# EAGLE schematic design (EAGLE 7.3.0)

## Sheet 1 of 7: MCU
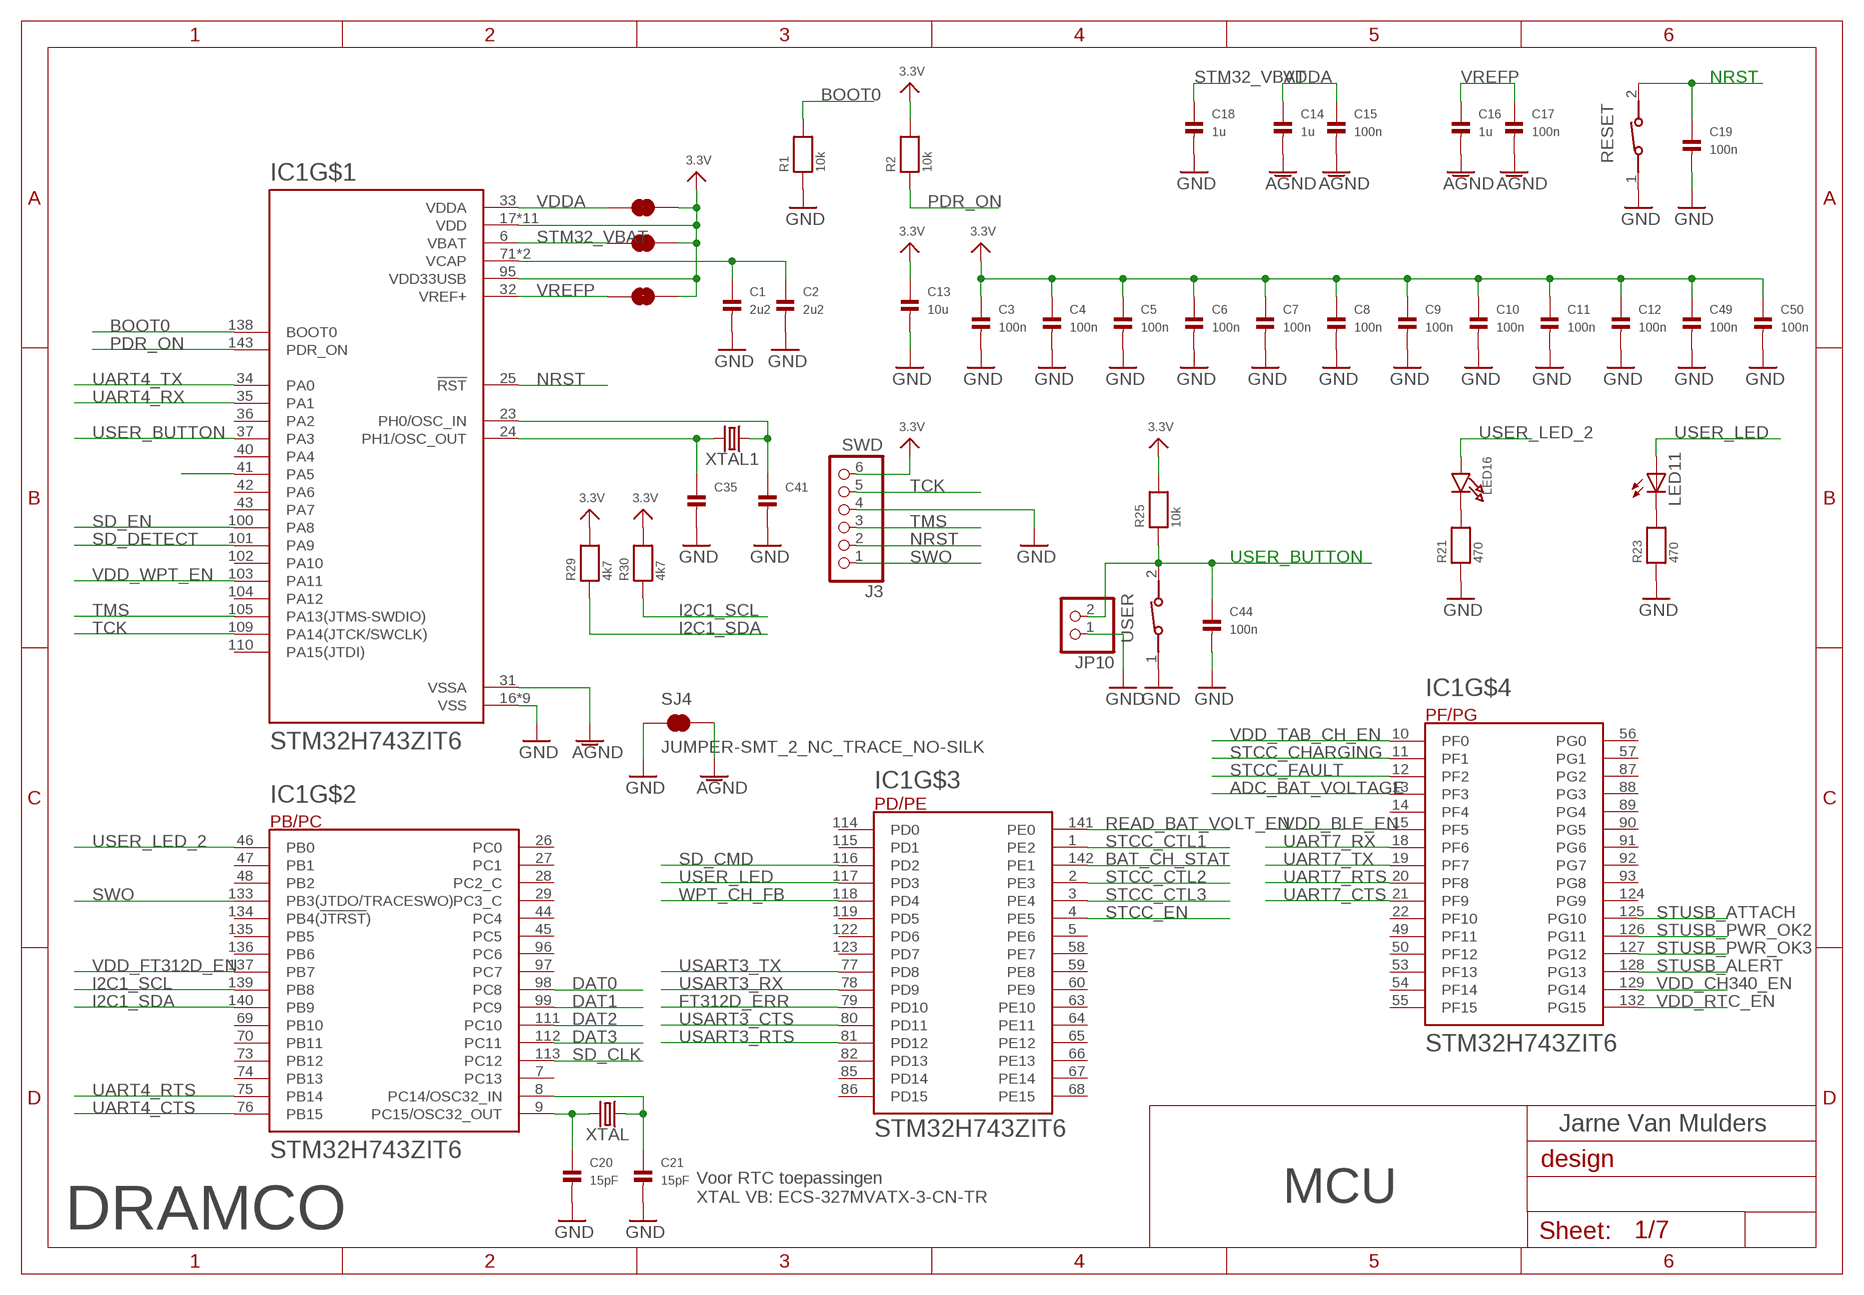
[diagram p0: schematic, sheet 1]

### Parts
C1  2u2  CAP_CERAMIC0805  [0805]
C2  2u2  CAP_CERAMIC0805  [0805]
C3  100n  CAP_CERAMIC0603  [0603]
C4  100n  CAP_CERAMIC0603  [0603]
C5  100n  CAP_CERAMIC0603  [0603]
C6  100n  CAP_CERAMIC0603  [0603]
C7  100n  CAP_CERAMIC0603  [0603]
C8  100n  CAP_CERAMIC0603  [0603]
C9  100n  CAP_CERAMIC0603  [0603]
C10  100n  CAP_CERAMIC0603  [0603]
C11  100n  CAP_CERAMIC0603  [0603]
C12  100n  CAP_CERAMIC0603  [0603]
C13  10u  CAP_CERAMIC0805  [0805]
C14  1u  CAP_CERAMIC0603  [0603]
C15  100n  CAP_CERAMIC0603  [0603]
C16  1u  CAP_CERAMIC0603  [0603]
C17  100n  CAP_CERAMIC0603  [0603]
C18  1u  CAP_CERAMIC0603  [0603]
C19  100n  CAP_CERAMIC0603  [0603]
C20  15pF  CAP_CERAMIC0603  [0603]
C21  15pF  CAP_CERAMIC0603  [0603]
C35  CAP_CERAMIC0603  [0603]
C41  CAP_CERAMIC0603  [0603]
C44  100n  CAP_CERAMIC0603  [0603]
C49  100n  CAP_CERAMIC0603  [0603]
C50  100n  CAP_CERAMIC0603  [0603]
IC1  STM32H743ZIT6  [QFP50P2200X2200X160-144N]
J3  SWD  HEADER-1X6ROUND  [1X06_ROUND]
JP10  HEADER-1X2ROUND  [1X02_ROUND]
LED11  LED3MM  [LED3MM]
LED16  LED0805  [CHIPLED_0805]
R1  10k  RESISTOR0603  [0603]
R2  10k  RESISTOR0603  [0603]
R21  470  RESISTOR0603  [0603]
R23  470  RESISTOR0603  [0603]
R25  10k  RESISTOR0603  [0603]
R29  4k7  RESISTOR0603  [0603]
R30  4k7  RESISTOR0603  [0603]
RESET  434111043826  [434111043826]
SJ1  JUMPER-SMT_2_NC_TRACE_NO-SILK  [SMT-JUMPER_2_NC_TRACE_NO-SILK]
SJ2  JUMPER-SMT_2_NC_TRACE_NO-SILK  [SMT-JUMPER_2_NC_TRACE_NO-SILK]
SJ3  JUMPER-SMT_2_NC_TRACE_NO-SILK  [SMT-JUMPER_2_NC_TRACE_NO-SILK]
SJ4  JUMPER-SMT_2_NC_TRACE_NO-SILK  [SMT-JUMPER_2_NC_TRACE_NO-SILK]
USER  434111043826  [434111043826]
XTAL  CRYSTALSMD-3.2X2.5  [CRYSTAL-SMD-3.2X2.5MM]
XTAL1  CRYSTALSMD-3.2X2.5  [CRYSTAL-SMD-3.2X2.5MM]

### Nets
3.3V: C3.1 C4.1 C5.1 C6.1 C7.1 C8.1 C9.1 C10.1 C11.1 C12.1 C13.1 C49.1 C50.1 IC1.17(VDD) IC1.30(VDD) IC1.39(VDD) IC1.52(VDD) IC1.62(VDD) IC1.72(VDD) IC1.84(VDD) IC1.95(VDD33USB) IC1.108(VDD) IC1.121(VDD) IC1.131(VDD) IC1.144(VDD) J3.6 R2.2 R25.2 R29.2 R30.2 SJ1.2 SJ2.2 SJ3.2 ; also sheet 2,3,4,5,6
ADC_BAT_VOLTAGE: IC1.13(PF3) ; also sheet 4
AGND: C14.2 C15.2 C16.2 C17.2 IC1.31(VSSA) SJ4.2
BAT_CH_STAT: IC1.142(PE1) ; also sheet 6
BOOT0: IC1.138(BOOT0) R1.2
DAT0: IC1.98(PC8) ; also sheet 5
DAT1: IC1.99(PC9) ; also sheet 5
DAT2: IC1.111(PC10) ; also sheet 5
DAT3: IC1.112(PC11) ; also sheet 5
FT312D_ERR: IC1.79(PD10) ; also sheet 3
GND: C1.2 C2.2 C3.2 C4.2 C5.2 C6.2 C7.2 C8.2 C9.2 C10.2 C11.2 C12.2 C13.2 C18.2 C19.2 C20.2 C21.2 C35.2 C41.2 C44.2 C49.2 C50.2 IC1.16(VSS) IC1.38(VSS) IC1.51(VSS) IC1.61(VSS) IC1.83(VSS) IC1.94(VSS) IC1.107(VSS) IC1.120(VSS) IC1.130(VSS) J3.4 JP10.1 R1.1 R21.1 R23.1 RESET.1 SJ4.1 USER.1 ; also sheet 2,3,4,5,6
I2C1_SCL: IC1.139(PB8) R30.1 ; also sheet 5,6
I2C1_SDA: IC1.140(PB9) R29.1 ; also sheet 5,6
N$2: C1.1 C2.1 IC1.71(VCAP) IC1.106(VCAP)
N$3: C20.1 IC1.9(PC15/OSC32_OUT) XTAL.3
N$4: C21.1 IC1.8(PC14/OSC32_IN) XTAL.1
N$9: IC1.41(PA5)
N$18: LED16.C R21.2
N$22: C35.1 IC1.24(PH1/OSC_OUT) XTAL1.3
N$38: LED11.K(C) R23.2
N$47: C41.1 IC1.23(PH0/OSC_IN) XTAL1.1
NRST: C19.1 IC1.25(!RST) J3.2 RESET.2
PDR_ON: IC1.143(PDR_ON) R2.1
READ_BAT_VOLT_EN: IC1.141(PE0) ; also sheet 4
SD_CLK: IC1.113(PC12) ; also sheet 5
SD_CMD: IC1.116(PD2) ; also sheet 5
SD_DETECT: IC1.101(PA9) ; also sheet 5
SD_EN: IC1.100(PA8) ; also sheet 5
STCC_CHARGING: IC1.11(PF1) ; also sheet 4
STCC_CTL1: IC1.1(PE2) ; also sheet 4
STCC_CTL2: IC1.2(PE3) ; also sheet 4
STCC_CTL3: IC1.3(PE4) ; also sheet 4
STCC_EN: IC1.4(PE5) ; also sheet 4
STCC_FAULT: IC1.12(PF2) ; also sheet 4
STM32_VBAT: C18.1 IC1.6(VBAT) SJ2.1
STUSB_ALERT: IC1.128(PG13) ; also sheet 6
STUSB_ATTACH: IC1.125(PG10) ; also sheet 6
STUSB_PWR_OK2: IC1.126(PG11) ; also sheet 6
STUSB_PWR_OK3: IC1.127(PG12) ; also sheet 6
SWO: IC1.133(PB3(JTDO/TRACESWO)) J3.1
TCK: IC1.109(PA14(JTCK/SWCLK)) J3.5
TMS: IC1.105(PA13(JTMS-SWDIO)) J3.3
UART4_CTS: IC1.76(PB15) ; also sheet 2
UART4_RTS: IC1.75(PB14) ; also sheet 2
UART4_RX: IC1.35(PA1) ; also sheet 2
UART4_TX: IC1.34(PA0) ; also sheet 2
UART7_CTS: IC1.21(PF9) ; also sheet 3
UART7_RTS: IC1.20(PF8) ; also sheet 3
UART7_RX: IC1.18(PF6) ; also sheet 3
UART7_TX: IC1.19(PF7) ; also sheet 3
USART3_CTS: IC1.80(PD11) ; also sheet 3
USART3_RTS: IC1.81(PD12) ; also sheet 3
USART3_RX: IC1.78(PD9) ; also sheet 3
USART3_TX: IC1.77(PD8) ; also sheet 3
USER_BUTTON: C44.1 IC1.37(PA3) JP10.2 R25.1 USER.2
USER_LED: IC1.117(PD3) LED11.A
USER_LED_2: IC1.46(PB0) LED16.A
VDD_BLE_EN: IC1.15(PF5) ; also sheet 2
VDD_CH340_EN: IC1.129(PG14) ; also sheet 3
VDD_FT312D_EN: IC1.137(PB7) ; also sheet 3
VDD_RTC_EN: IC1.132(PG15) ; also sheet 5
VDD_TAB_CH_EN: IC1.10(PF0) ; also sheet 4
VDD_WPT_EN: IC1.103(PA11) ; also sheet 4
VDDA: C14.1 C15.1 IC1.33(VDDA) SJ3.1
VREFP: C16.1 C17.1 IC1.32(VREF+) SJ1.1
WPT_CH_FB: IC1.118(PD4) ; also sheet 4
Unconnected: IC1.5(PE6) IC1.7(PC13) IC1.14(PF4) IC1.22(PF10) IC1.26(PC0) IC1.27(PC1) IC1.28(PC2_C) IC1.29(PC3_C) IC1.36(PA2) IC1.40(PA4) IC1.42(PA6) IC1.43(PA7) IC1.44(PC4) IC1.45(PC5) IC1.47(PB1) IC1.48(PB2) IC1.49(PF11) IC1.50(PF12) IC1.53(PF13) IC1.54(PF14) IC1.55(PF15) IC1.56(PG0) IC1.57(PG1) IC1.58(PE7) IC1.59(PE8) IC1.60(PE9) IC1.63(PE10) IC1.64(PE11) IC1.65(PE12) IC1.66(PE13) IC1.67(PE14) IC1.68(PE15) IC1.69(PB10) IC1.70(PB11) IC1.73(PB12) IC1.74(PB13) IC1.82(PD13) IC1.85(PD14) IC1.86(PD15) IC1.87(PG2) IC1.88(PG3) IC1.89(PG4) IC1.90(PG5) IC1.91(PG6) IC1.92(PG7) IC1.93(PG8) IC1.96(PC6) IC1.97(PC7) IC1.102(PA10) IC1.104(PA12) IC1.110(PA15(JTDI)) IC1.114(PD0) IC1.115(PD1) IC1.119(PD5) IC1.122(PD6) IC1.123(PD7) IC1.124(PG9) IC1.134(PB4(!JTRST!)) IC1.135(PB5) IC1.136(PB6)

### Notes on the sheet
- Jarne Van Mulders
- Voor RTC toepassingen
  XTAL VB: ECS-327MVATX-3-CN-TR
- MCU
- DRAMCO

## Sheet 2 of 7: Bluetooth
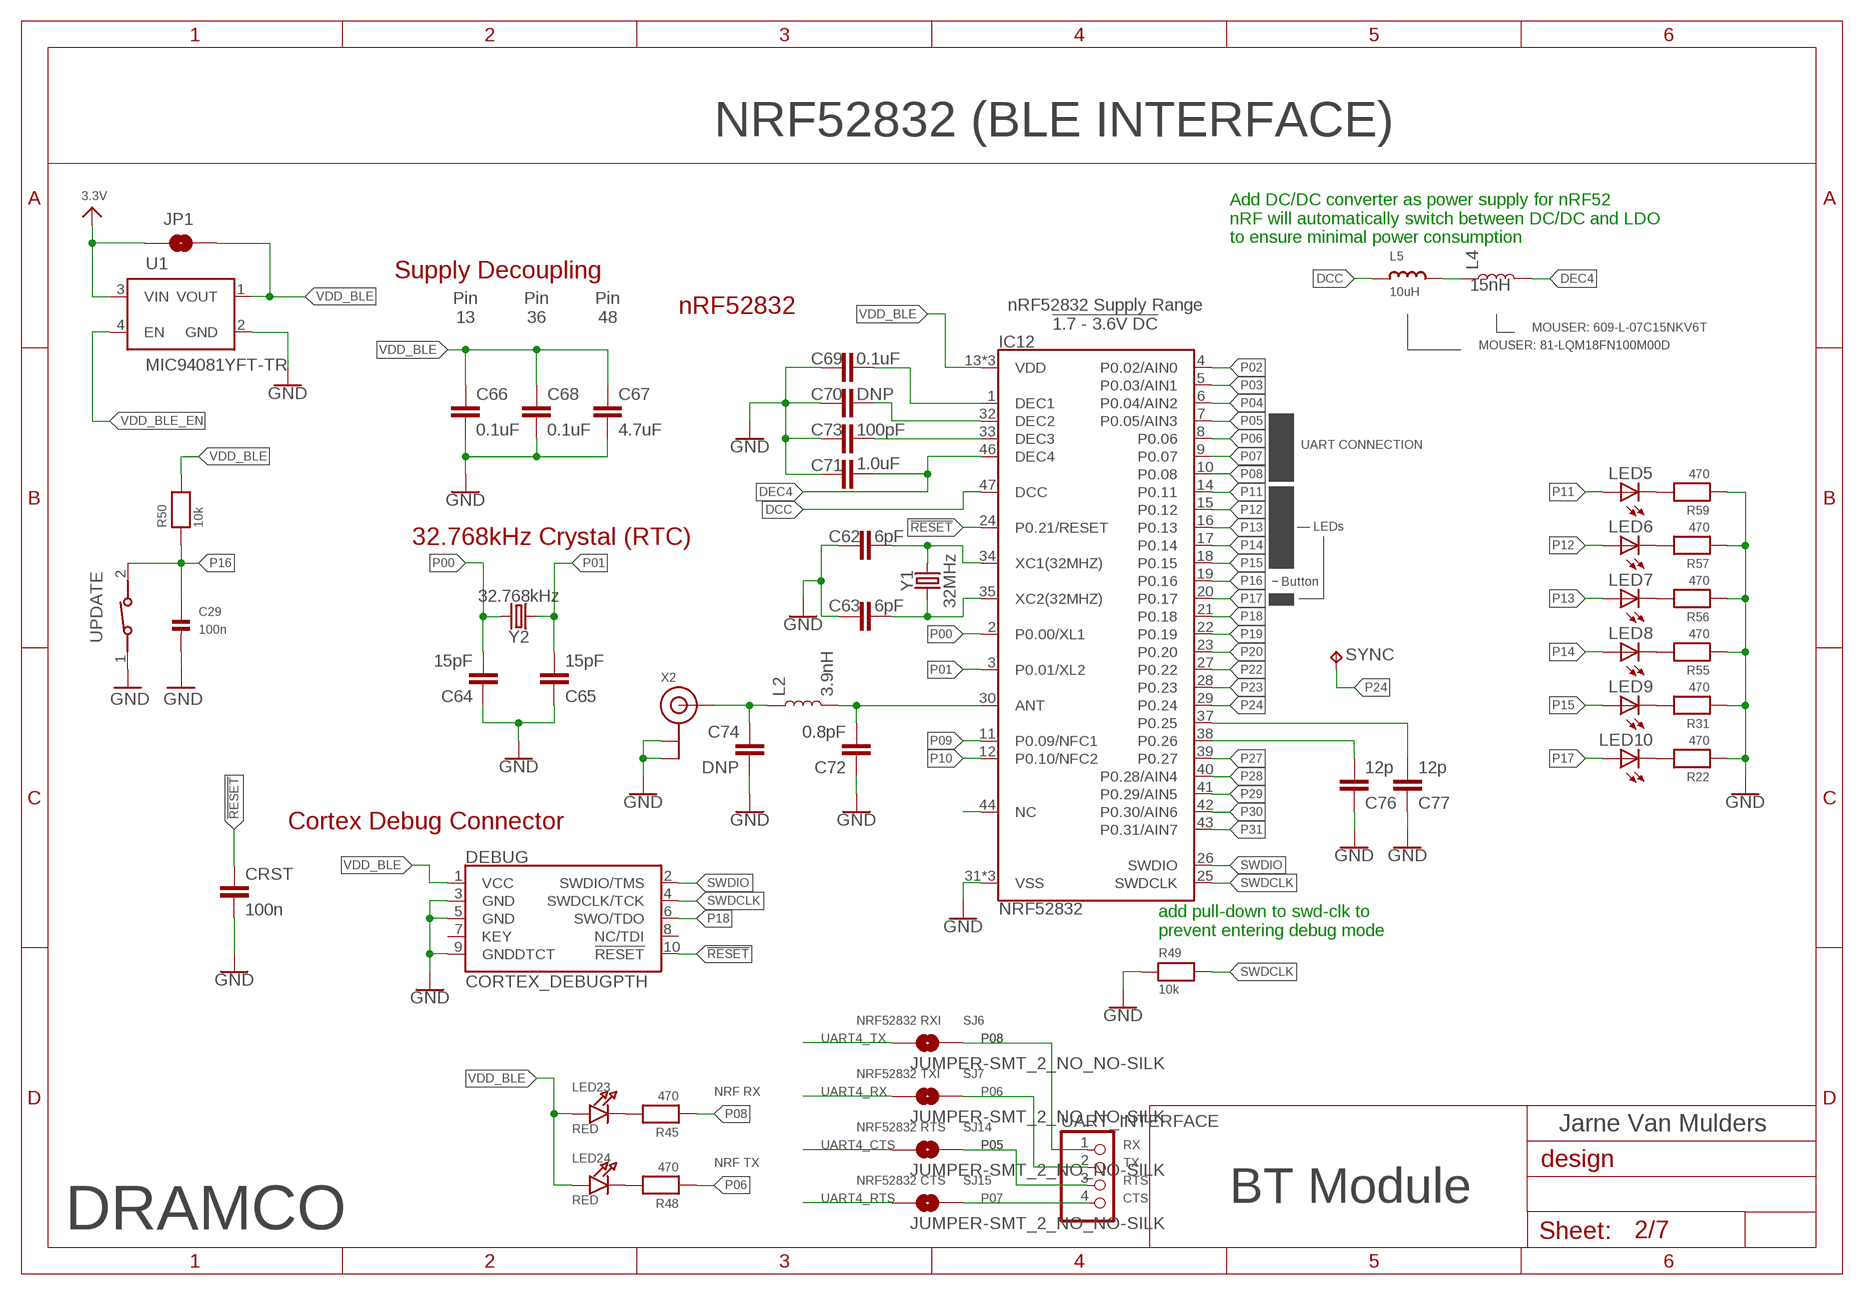
[diagram p1: schematic, sheet 2]

### Parts
C29  100n  CAP_CERAMIC0603  [0603]
C62  6pF  6PF-0402-50V-0.5%  [0402]
C63  6pF  6PF-0402-50V-0.5%  [0402]
C64  15pF  15PF-0402-50V-5%  [0402]
C65  15pF  15PF-0402-50V-5%  [0402]
C66  0.1uF  0.1UF-0402-16V-10%  [0402]
C67  4.7uF  4.7UF0603  [0603]
C68  0.1uF  0.1UF-0402-16V-10%  [0402]
C69  0.1uF  0.1UF-0402-16V-10%  [0402]
C70  DNP  CAP0402  [0402]
C71  1.0uF  1.0UF-0402-16V-10%  [0402]
C72  0.8pF  0.8PF-0402-50V-0.1PF  [0402]
C73  100pF  100PF-0402-50V-5%  [0402]
C74  DNP  CAP0402  [0402]
C76  12p  15PF-0402-50V-5%  [0402]
C77  12p  15PF-0402-50V-5%  [0402]
CRST  100n  C-EUC0603  [C0603]
DEBUG  CORTEX_DEBUGPTH  [2X5-PTH-1.27MM]
IC12  NRF52832  [QFN48-6X6MM]
JP1  JUMPER-SMT_2_NO_NO-SILK  [SMT-JUMPER_2_NO_NO-SILK]
L2  3.9nH  INDUCTOR-0402-3.9NH  [0402]
L4  15nH  INDUCTOR-0402-3.9NH  [0402]
L5  10uH  INDUCTOR_0603MP  [_0603MP]
LED5  LED3MM  [LED3MM]
LED6  LED3MM  [LED3MM]
LED7  LED3MM  [LED3MM]
LED8  LED3MM  [LED3MM]
LED9  LED3MM  [LED3MM]
LED10  LED3MM  [LED3MM]
LED23  RED  LED0805  [CHIPLED_0805]
LED24  RED  LED0805  [CHIPLED_0805]
R22  470  RESISTOR0603  [0603]
R31  470  RESISTOR0603  [0603]
R45  470  RESISTOR0603  [0603]
R48  470  RESISTOR0603  [0603]
R49  10k  RESISTOR0603  [0603]
R50  10k  RESISTOR0603  [0603]
R55  470  RESISTOR0603  [0603]
R56  470  RESISTOR0603  [0603]
R57  470  RESISTOR0603  [0603]
R59  470  RESISTOR0603  [0603]
SJ6  JUMPER-SMT_2_NO_NO-SILK  [SMT-JUMPER_2_NO_NO-SILK]
SJ7  JUMPER-SMT_2_NO_NO-SILK  [SMT-JUMPER_2_NO_NO-SILK]
SJ14  JUMPER-SMT_2_NO_NO-SILK  [SMT-JUMPER_2_NO_NO-SILK]
SJ15  JUMPER-SMT_2_NO_NO-SILK  [SMT-JUMPER_2_NO_NO-SILK]
SYNC  TPTP09R  [TP09R]
U1  MIC94081YFT-TR  [IC_MIC94081YFT-TR]
UART_INTERFACE  HEADER-1X4ROUND  [1X04_ROUND]
UPDATE  434111043826  [434111043826]
X2  ANTENNA_U.FL  [U.FL]
Y1  32MHz  CRYSTAL-32MHZ-SMD-2.0X1.6MM  [CRYSTAL-SMD-2.0X1.6MM]
Y2  32.768kHz  CRYSTAL-32.768KHZSMD-3.2X1.5  [CRYSTAL-SMD-3.2X1.5MM]

### Nets
3.3V: JP1.1 U1.3(VIN) ; also sheet 1,3,4,5,6
!RESET!: CRST.1 DEBUG.10(!RESET) IC12.24(P0.21/RESET)
ANT: C72.2 IC12.30(ANT) L2.2
DCC: IC12.47(DCC) L5.1
DEC4: C71.2 IC12.46(DEC4) L4.2
DEC5: C69.2 IC12.1(DEC1)
DEC6: C70.2 IC12.32(DEC2)
DEC8: C73.2 IC12.33(DEC3)
GND: C29.2 C62.1 C63.2 C64.1 C65.1 C66.2 C67.2 C68.2 C69.1 C70.1 C71.1 C72.1 C73.1 C74.2 C76.1 C77.1 CRST.2 DEBUG.3(GND) DEBUG.5(GND) DEBUG.9(GNDDTCT) IC12.31(VSS) IC12.45(VSS) IC12.EP(VSS) R22.1 R31.1 R49.1 R55.1 R56.1 R57.1 R59.1 U1.2(GND) UPDATE.1 X2.1(GND) X2.2(GND) ; also sheet 1,3,4,5,6
N$10: LED10.K(C) R22.2
N$11: LED9.K(C) R31.2
N$19: LED8.K(C) R55.2
N$45: C74.1 L2.1 X2.3(SIGNAL)
N$46: LED7.K(C) R56.2
N$48: LED6.K(C) R57.2
N$49: LED23.C R45.2
N$50: C77.2 IC12.37(P0.25)
N$51: LED24.C R48.2
N$53: L4.1 L5.2
N$61: LED5.K(C) R59.2
NC: IC12.44(NC)
P00: C64.2 IC12.2(P0.00/XL1) Y2.P$2
P01: C65.2 IC12.3(P0.01/XL2) Y2.P$1
P02: IC12.4(P0.02/AIN0)
P03: IC12.5(P0.03/AIN1)
P04: IC12.6(P0.04/AIN2)
P05: IC12.7(P0.05/AIN3) SJ14.2 UART_INTERFACE.3
P06: IC12.8(P0.06) R48.1 SJ7.2 UART_INTERFACE.2
P07: IC12.9(P0.07) SJ15.2 UART_INTERFACE.4
P08: IC12.10(P0.08) R45.1 SJ6.2 UART_INTERFACE.1
P09: IC12.11(P0.09/NFC1)
P10: IC12.12(P0.10/NFC2)
P11: IC12.14(P0.11) LED5.A
P12: IC12.15(P0.12) LED6.A
P13: IC12.16(P0.13) LED7.A
P14: IC12.17(P0.14) LED8.A
P15: IC12.18(P0.15) LED9.A
P16: C29.1 IC12.19(P0.16) R50.1 UPDATE.2
P17: IC12.20(P0.17) LED10.A
P18: DEBUG.6(SWO/TDO) IC12.21(P0.18)
P19: IC12.22(P0.19)
P20: IC12.23(P0.20)
P22: IC12.27(P0.22)
P23: IC12.28(P0.23)
P24: IC12.29(P0.24) SYNC.TP
P26: C76.2 IC12.38(P0.26)
P27: IC12.39(P0.27)
P28: IC12.40(P0.28/AIN4)
P29: IC12.41(P0.29/AIN5)
P30: IC12.42(P0.30/AIN6)
P31: IC12.43(P0.31/AIN7)
SWDCLK: DEBUG.4(SWDCLK/TCK) IC12.25(SWDCLK) R49.2
SWDIO: DEBUG.2(SWDIO/TMS) IC12.26(SWDIO)
UART4_CTS: SJ14.1 ; also sheet 1
UART4_RTS: SJ15.1 ; also sheet 1
UART4_RX: SJ7.1 ; also sheet 1
UART4_TX: SJ6.1 ; also sheet 1
VDD_BLE: C66.1 C67.1 C68.1 DEBUG.1(VCC) IC12.13(VDD) IC12.36(VDD) IC12.48(VDD) JP1.2 LED23.A LED24.A R50.2 U1.1(VOUT)
VDD_BLE_EN: U1.4(EN) ; also sheet 1
XC1: C62.2 IC12.34(XC1(32MHZ)) Y1.3
XC2: C63.1 IC12.35(XC2(32MHZ)) Y1.1
Unconnected: DEBUG.7(KEY) DEBUG.8(NC/TDI)

### Notes on the sheet
- NRF52832 (BLE INTERFACE)
- Add DC/DC converter as power supply for nRF52
  nRF will automatically switch between DC/DC and LDO
  to ensure minimal power consumption
- Supply Decoupling
- nRF52832
- nRF52832 Supply Range
  !1.7 - 3.6V DC!
- Pin
  13
- Pin
  36
- Pin
  48
- MOUSER: 609-L-07C15NKV6T
- MOUSER: 81-LQM18FN100M00D
- UART CONNECTION
- LEDs
- 32.768kHz Crystal (RTC)
- Button
- Cortex Debug Connector
- add pull-down to swd-clk to 
  prevent entering debug mode
- NRF52832 RXI
- NRF52832 TXI
- NRF RX
- NRF52832 RTS | Jarne Van Mulders
- RX
- NRF TX | TX
- NRF52832 CTS | RTS
- CTS | BT Module
- DRAMCO

## Sheet 3 of 7: USB Controllers
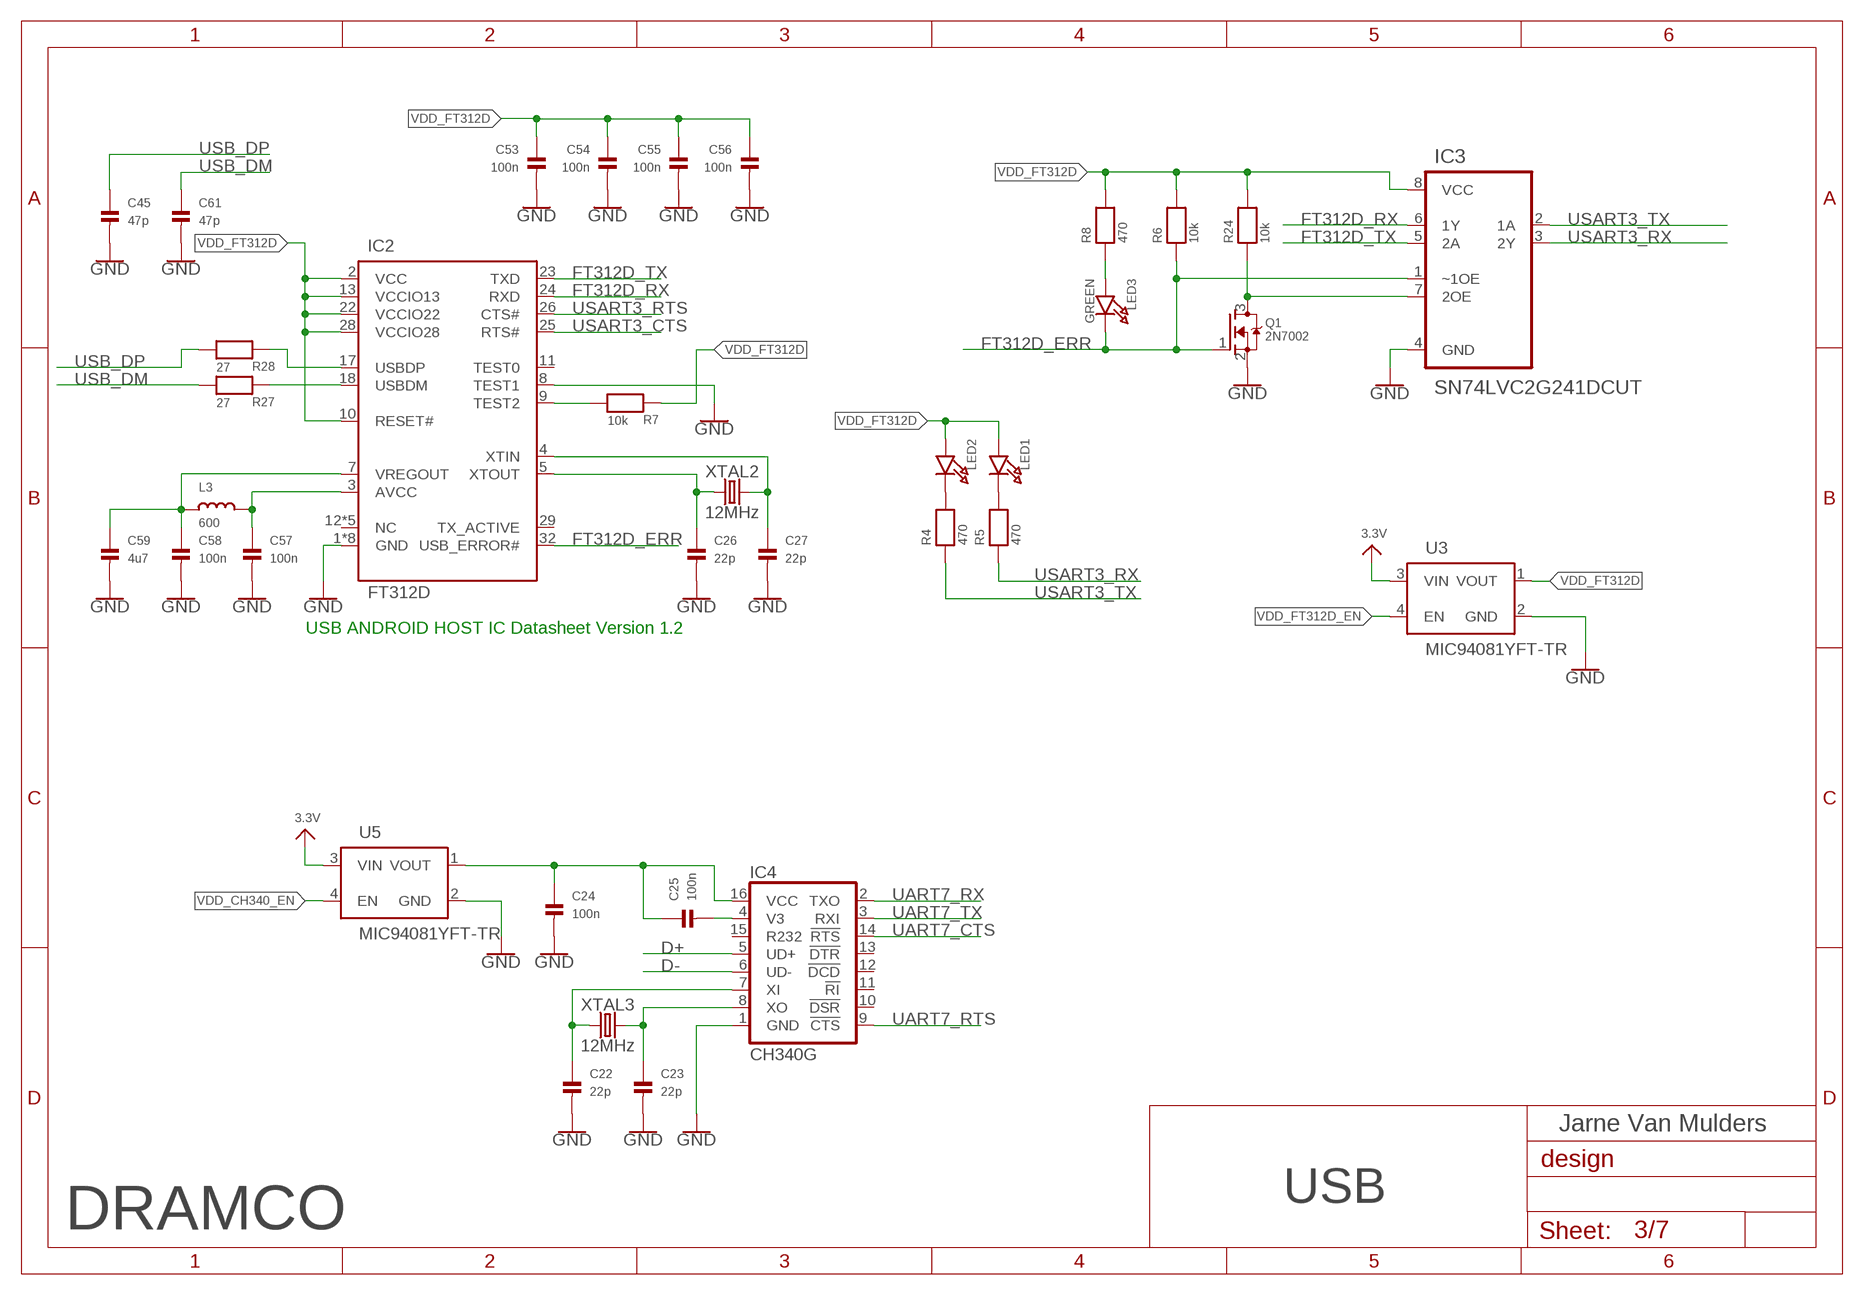
[diagram p2: schematic, sheet 3]

### Parts
C22  22p  CAP_CERAMIC0603  [0603]
C23  22p  CAP_CERAMIC0603  [0603]
C24  100n  CAP_CERAMIC0603  [0603]
C25  100n  CAP_CERAMIC0603  [0603]
C26  22p  CAP_CERAMIC0603  [0603]
C27  22p  CAP_CERAMIC0603  [0603]
C45  47p  CAP_CERAMIC0603  [0603]
C53  100n  CAP_CERAMIC0603  [0603]
C54  100n  CAP_CERAMIC0603  [0603]
C55  100n  CAP_CERAMIC0603  [0603]
C56  100n  CAP_CERAMIC0603  [0603]
C57  100n  CAP_CERAMIC0603  [0603]
C58  100n  CAP_CERAMIC0603  [0603]
C59  4u7  CAP_CERAMIC0603  [0603]
C61  47p  CAP_CERAMIC0603  [0603]
IC2  FT312D  [QFP80P900X900X160-32N]
IC3  SN74LVC2G241DCUT  [SOP50P310X90-8N]
IC4  CH340G  CH340GSMD  [SO016]
L3  600  INDUCTOR0603  [0603]
LED1  LED0805  [CHIPLED_0805]
LED2  LED0805  [CHIPLED_0805]
LED3  GREEN  LED0805  [CHIPLED_0805]
Q1  2N7002  MOSFET-NWIDE  [SOT23-WIDE]
R4  470  RESISTOR0603  [0603]
R5  470  RESISTOR0603  [0603]
R6  10k  RESISTOR0603  [0603]
R7  10k  RESISTOR0603  [0603]
R8  470  RESISTOR0603  [0603]
R24  10k  RESISTOR0603  [0603]
R27  27  RESISTOR0603  [0603]
R28  27  RESISTOR0603  [0603]
U3  MIC94081YFT-TR  [IC_MIC94081YFT-TR]
U5  MIC94081YFT-TR  [IC_MIC94081YFT-TR]
XTAL2  12MHz  CRYSTALSMD-3.2X2.5  [CRYSTAL-SMD-3.2X2.5MM]
XTAL3  12MHz  CRYSTALSMD-3.2X2.5  [CRYSTAL-SMD-3.2X2.5MM]

### Nets
3.3V: U3.3(VIN) U5.3(VIN) ; also sheet 1,2,4,5,6
D+: IC4.5(UD+) ; also sheet 6
D-: IC4.6(UD-) ; also sheet 6
FT312D_ERR: IC2.32(USB_ERROR#) IC3.1(~1OE) LED3.C Q1.1(G) R6.1 ; also sheet 1
FT312D_RX: IC2.24(RXD) IC3.6(1Y)
FT312D_TX: IC2.23(TXD) IC3.5(2A)
GND: C22.2 C23.2 C24.2 C26.2 C27.2 C45.2 C53.2 C54.2 C55.2 C56.2 C57.2 C58.2 C59.2 C61.2 IC2.1(GND) IC2.6(GND) IC2.8(TEST1) IC2.14(GND) IC2.15(GND) IC2.16(GND) IC2.19(GND) IC2.27(GND) IC2.33(GND) IC3.4(GND) IC4.1(GND) Q1.2(S) U3.2(GND) U5.2(GND) ; also sheet 1,2,4,5,6
N$1: LED2.C R4.2
N$5: LED1.C R5.2
N$6: C27.1 IC2.4(XTIN) XTAL2.3
N$7: C26.1 IC2.5(XTOUT) XTAL2.1
N$12: C24.1 C25.1 IC4.16(VCC) U5.1(VOUT)
N$13: LED3.A R8.1
N$14: IC2.9(TEST2) R7.1
N$15: IC3.7(2OE) Q1.3(D) R24.1
N$29: C22.1 IC4.7(XI) XTAL3.1
N$32: C23.1 IC4.8(XO) XTAL3.3
N$34: C25.2 IC4.4(V3)
N$41: C58.1 C59.1 IC2.7(VREGOUT) L3.1
N$42: C57.1 IC2.3(AVCC) L3.2
N$43: IC2.18(USBDM) R27.2
N$44: IC2.17(USBDP) R28.2
UART7_CTS: IC4.14(!RTS) ; also sheet 1
UART7_RTS: IC4.9(!CTS) ; also sheet 1
UART7_RX: IC4.2(TXO) ; also sheet 1
UART7_TX: IC4.3(RXI) ; also sheet 1
USART3_CTS: IC2.25(RTS#) ; also sheet 1
USART3_RTS: IC2.26(CTS#) ; also sheet 1
USART3_RX: IC3.3(2Y) R5.1 ; also sheet 1
USART3_TX: IC3.2(1A) R4.1 ; also sheet 1
USB_DM: C61.1 R27.1 ; also sheet 4
USB_DP: C45.1 R28.1 ; also sheet 4
VDD_CH340_EN: U5.4(EN) ; also sheet 1
VDD_FT312D: C53.1 C54.1 C55.1 C56.1 IC2.2(VCC) IC2.10(RESET#) IC2.13(VCCIO13) IC2.22(VCCIO22) IC2.28(VCCIO28) IC3.8(VCC) LED1.A LED2.A R6.2 R7.2 R8.2 R24.2 U3.1(VOUT)
VDD_FT312D_EN: U3.4(EN) ; also sheet 1
Unconnected: IC2.11(TEST0) IC2.12(NC) IC2.20(NC) IC2.21(NC) IC2.29(TX_ACTIVE) IC2.30(NC) IC2.31(NC) IC4.10(!DSR) IC4.11(!RI) IC4.12(!DCD) IC4.13(!DTR) IC4.15(R232)

### Notes on the sheet
- USB ANDROID HOST IC Datasheet Version 1.2
- Jarne Van Mulders
- USB
- DRAMCO

## Sheet 4 of 7: Power
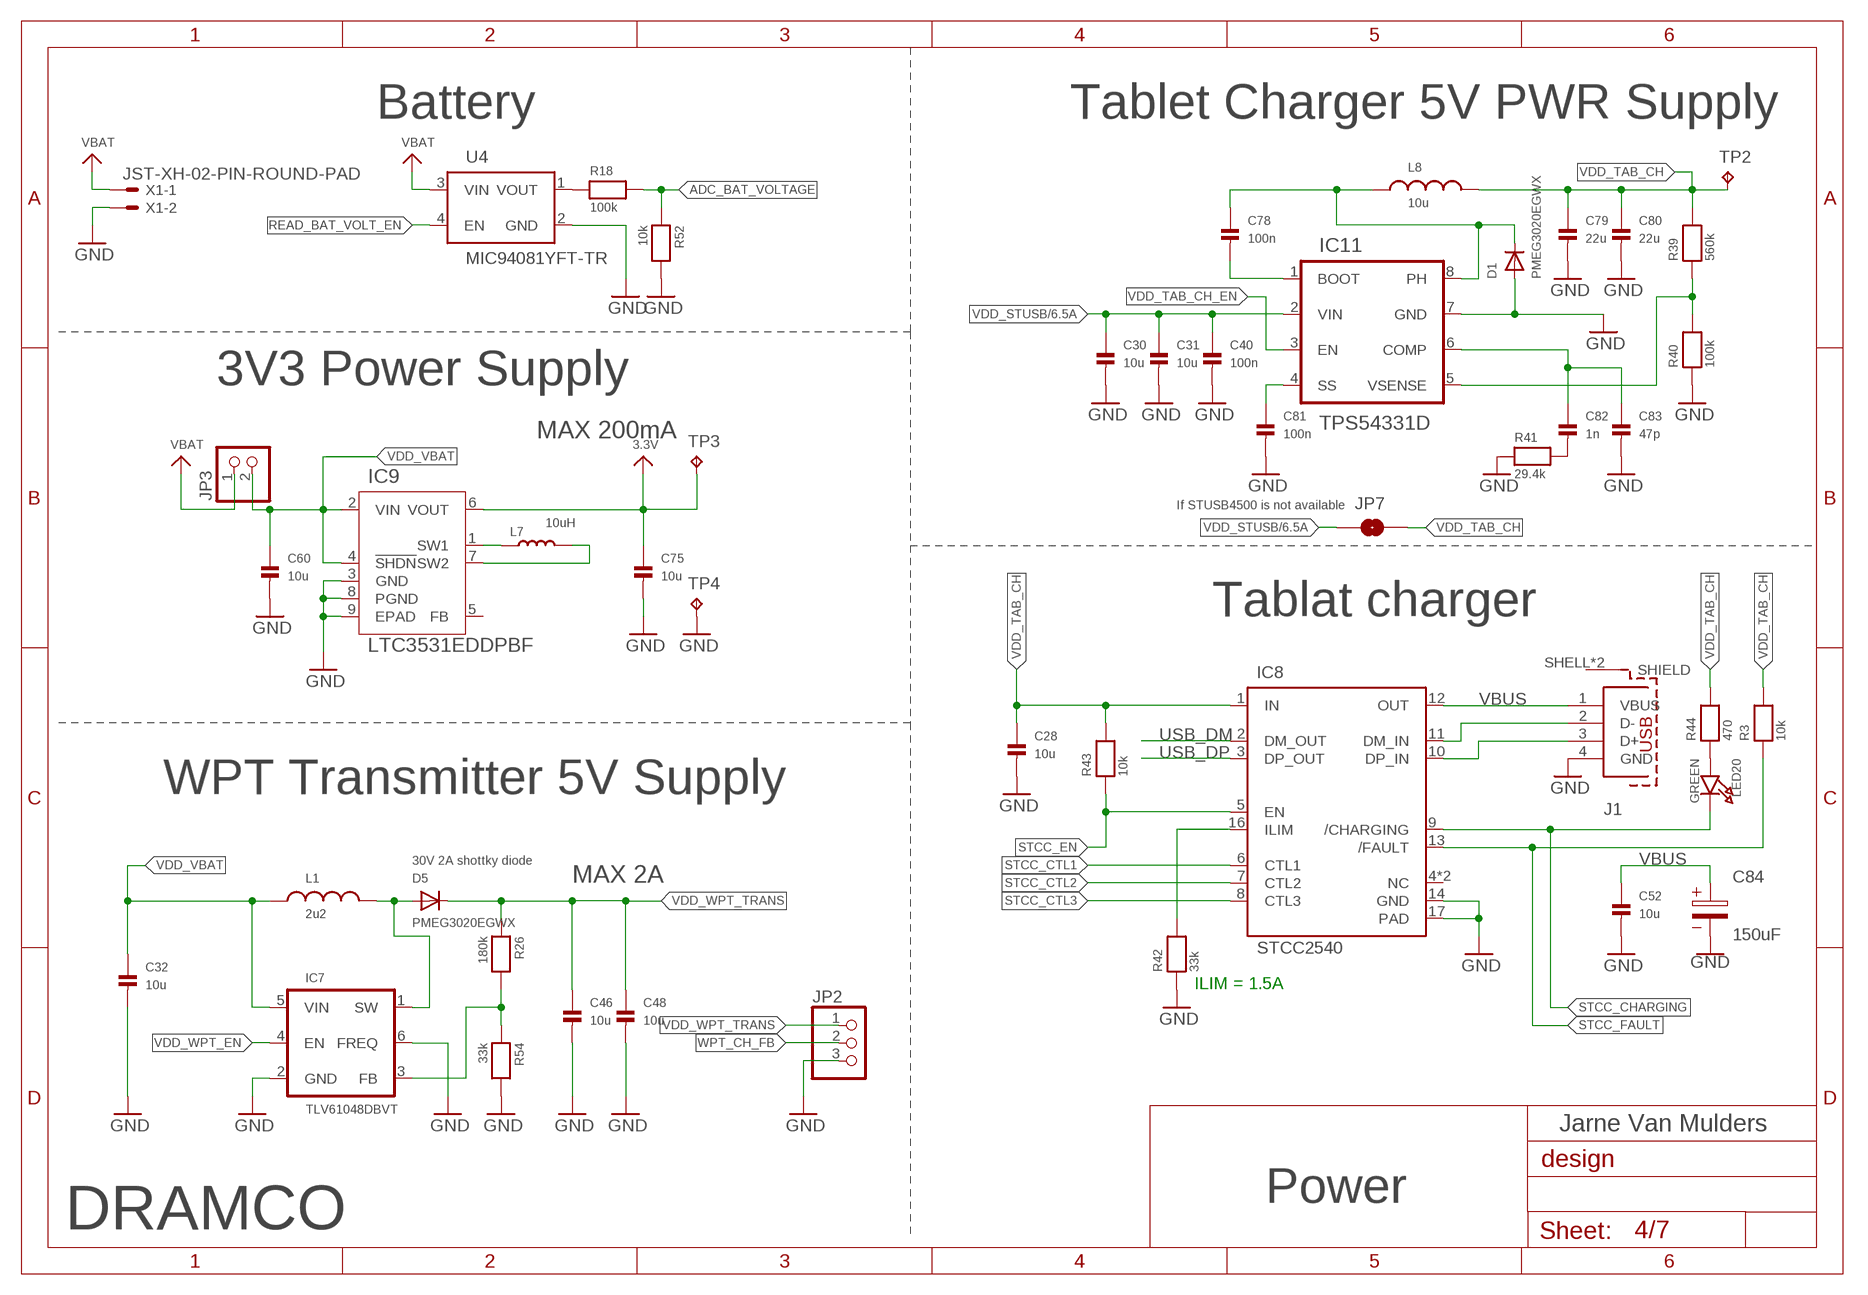
[diagram p3: schematic, sheet 4]

### Parts
C28  10u  CAP_CERAMIC0805  [0805]
C30  10u  CAP_CERAMIC0805  [0805]
C31  10u  CAP_CERAMIC0805  [0805]
C32  10u  CAP_CERAMIC0805  [0805]
C40  100n  CAP_CERAMIC0603  [0603]
C46  10u  CAP_CERAMIC0805  [0805]
C48  10u  CAP_CERAMIC0805  [0805]
C52  10u  CAP_CERAMIC0805  [0805]
C60  10u  CAP_CERAMIC0805  [0805]
C75  10u  CAP_CERAMIC0805  [0805]
C78  100n  CAP_CERAMIC0402  [0402]
C79  22u  CAP_CERAMIC0805  [0805]
C80  22u  CAP_CERAMIC0805  [0805]
C81  100n  CAP_CERAMIC0603  [0603]
C82  1n  CAP_CERAMIC0603  [0603]
C83  47p  CAP_CERAMIC0603  [0603]
C84  150uF  WCAP-ASLI_6,3X5,5_865080143008  [3.5X1.6X2.1(BXCXA)]
D1  PMEG3020EGWX  DIODESOD-123  [SOD-123]
D5  PMEG3020EGWX  DIODESOD-123  [SOD-123]
IC7  TLV61048DBVT  [SOT95P280X145-6N]
IC8  STCC2540  [QFN50P300X300X80-17N]
IC9  LTC3531EDDPBF  [DFN-8_DD]
IC11  TPS54331D  [SOIC127P599X175-8N]
J1  614004190021  [614004190021]
JP2  HEADER-1X3ROUND  [1X03_ROUND]
JP3  HEADER-1X2ROUND  [1X02_ROUND]
JP7  JUMPER-SMT_2_NO_NO-SILK  [SMT-JUMPER_2_NO_NO-SILK]
L1  2u2  WE-MAIA_3020_78438336022  [WE-MAIA_3020]
L7  10uH  SS4020-103MLB  [MSS4020]
L8  10u  WE-MAIA_4030_78438357100  [WE-MAIA_4030]
LED20  GREEN  LED0805  [CHIPLED_0805]
R3  10k  RESISTOR0603  [0603]
R18  100k  RESISTOR0603  [0603]
R26  180k  RESISTOR0603  [0603]
R39  560k  RESISTOR0603  [0603]
R40  100k  RESISTOR0603  [0603]
R41  29.4k  RESISTOR0603  [0603]
R42  33k  RESISTOR0603  [0603]
R43  10k  RESISTOR0603  [0603]
R44  470  RESISTOR0603  [0603]
R52  10k  RESISTOR0603  [0603]
R54  33k  RESISTOR0603  [0603]
TP2  TPTP10R  [TP10R]
TP3  TPTP10R  [TP10R]
TP4  TPTP10R  [TP10R]
U4  MIC94081YFT-TR  [IC_MIC94081YFT-TR]
X1  JST-XH-02-PIN-ROUND-PAD  [JST-XH-02-PACKAGE-ROUND-PAD]

### Nets
3.3V: C75.1 IC9.6(VOUT) TP3.TP ; also sheet 1,2,3,5,6
ADC_BAT_VOLTAGE: R18.2 R52.1 ; also sheet 1
GND: C28.2 C30.2 C31.2 C32.2 C40.2 C46.2 C48.2 C52.2 C60.2 C75.2 C79.2 C80.2 C81.2 C83.2 C84.2 D1.A IC7.2(GND) IC7.6(FREQ) IC8.14(GND) IC8.17(PAD) IC9.3(GND) IC9.8(PGND) IC9.9(EPAD) IC11.7(GND) J1.4(GND) JP2.3 R40.1 R41.1 R42.1 R52.2 R54.2 TP4.TP U4.2(GND) X1.2 ; also sheet 1,2,3,5,6
N$8: LED20.A R44.1
N$16: C78.1 D1.C IC11.8(PH) L8.1
N$17: D5.A IC7.1(SW) L1.2
N$24: IC8.16(ILIM) R42.2
N$28: R18.1 U4.1(VOUT)
N$33: C81.1 IC11.4(SS)
N$35: IC7.3(FB) R26.2 R54.1
N$36: C78.2 IC11.1(BOOT)
N$39: IC8.11(DM_IN) J1.2(D-)
N$40: IC8.10(DP_IN) J1.3(D+)
N$55: C82.1 C83.1 IC11.6(COMP)
N$57: IC11.5(VSENSE) R39.1 R40.2
N$60: C82.2 R41.2
READ_BAT_VOLT_EN: U4.4(EN) ; also sheet 1
STCC_CHARGING: IC8.9(/CHARGING) LED20.C ; also sheet 1
STCC_CTL1: IC8.6(CTL1) ; also sheet 1
STCC_CTL2: IC8.7(CTL2) ; also sheet 1
STCC_CTL3: IC8.8(CTL3) ; also sheet 1
STCC_EN: IC8.5(EN) R43.1 ; also sheet 1
STCC_FAULT: IC8.13(/FAULT) R3.1 ; also sheet 1
SW1: IC9.1(SW1) L7.1
SW2: IC9.7(SW2) L7.2
USB_DM: IC8.2(DM_OUT) ; also sheet 3
USB_DP: IC8.3(DP_OUT) ; also sheet 3
VBAT: JP3.1 U4.3(VIN) X1.1 ; also sheet 5,6
VBUS: C52.1 C84.1 IC8.12(OUT) J1.1(VBUS)
VDD_STUSB: C30.1 C31.1 C40.1 IC11.2(VIN) JP7.1 ; also sheet 6
VDD_TAB_CH: C28.1 C79.1 C80.1 IC8.1(IN) JP7.2 L8.2 R3.2 R39.2 R43.2 R44.2 TP2.TP
VDD_TAB_CH_EN: IC11.3(EN) ; also sheet 1
VDD_VBAT: C32.1 C60.1 IC7.5(VIN) IC9.2(VIN) IC9.4(!SHDN) JP3.2 L1.1
VDD_WPT_EN: IC7.4(EN) ; also sheet 1
VDD_WPT_TRANS: C46.1 C48.1 D5.C JP2.1 R26.1
WPT_CH_FB: JP2.2 ; also sheet 1
Unconnected: IC8.4(NC) IC8.15(NC) IC9.5(FB) J1.SHELL1(SHIELD) J1.SHELL(SHIELD)

### Notes on the sheet
- Battery | Tablet Charger 5V PWR Supply
- 3V3 Power Supply
- MAX 200mA
- If STUSB4500 is not available
- Tablat charger
- WPT Transmitter 5V Supply
- 30V 2A shottky diode
- MAX 2A
- ILIM = 1.5A
- Jarne Van Mulders
- Power
- DRAMCO

## Sheet 5 of 7: IO Exp
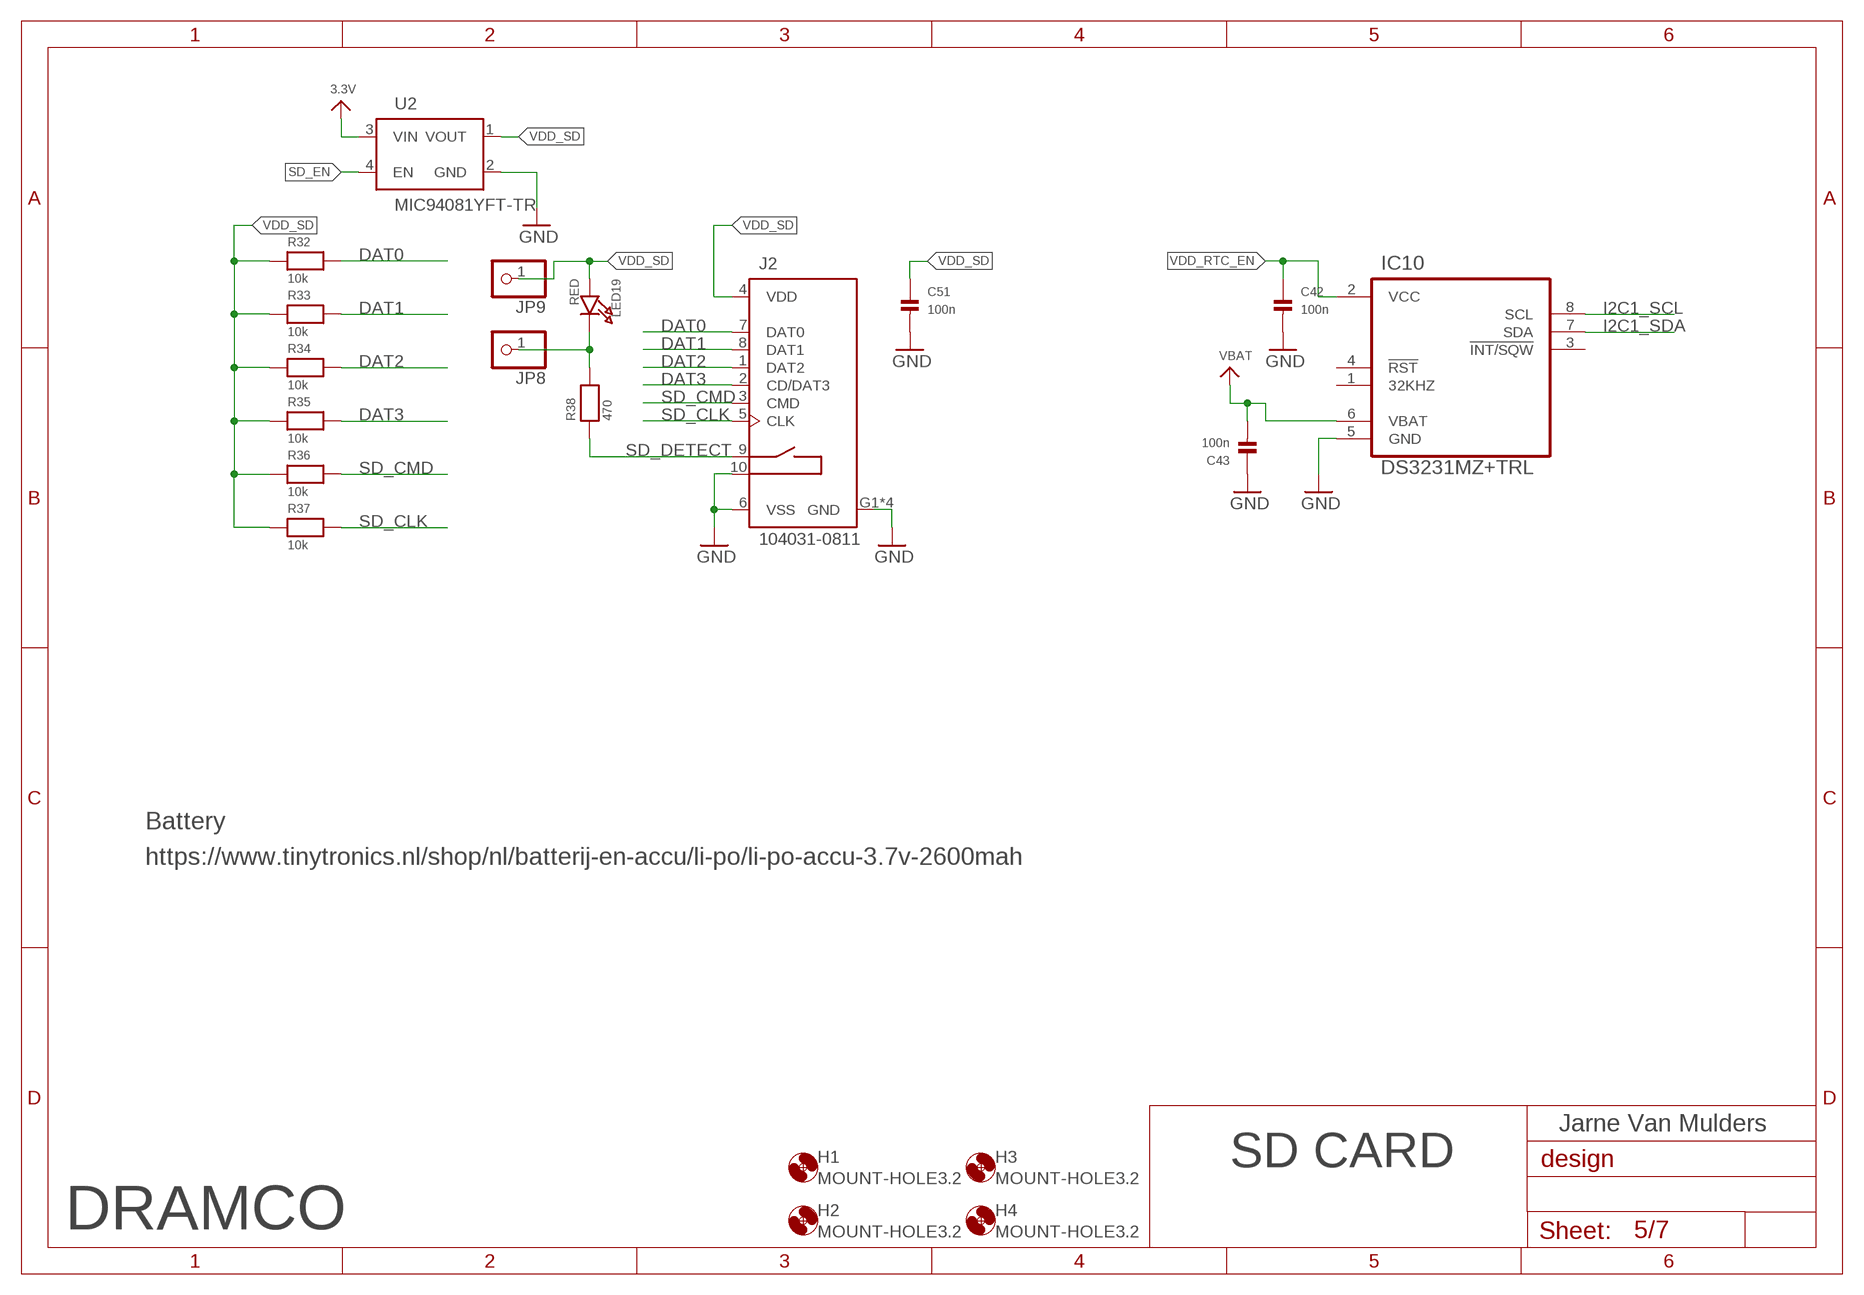
[diagram p4: schematic, sheet 5]

### Parts
C42  100n  CAP_CERAMIC0603  [0603]
C43  100n  CAP_CERAMIC0603  [0603]
C51  100n  CAP_CERAMIC0603  [0603]
H1  MOUNT-HOLE3.2  [3,2]
H2  MOUNT-HOLE3.2  [3,2]
H3  MOUNT-HOLE3.2  [3,2]
H4  MOUNT-HOLE3.2  [3,2]
IC10  DS3231MZ+TRL  [SOIC127P600X175-8N]
J2  104031-0811  [MOLEX_104031-0811]
JP8  HEADER-1X1ROUND  [1X01_ROUND]
JP9  HEADER-1X1ROUND  [1X01_ROUND]
LED19  RED  LED0805  [CHIPLED_0805]
R32  10k  RESISTOR0603  [0603]
R33  10k  RESISTOR0603  [0603]
R34  10k  RESISTOR0603  [0603]
R35  10k  RESISTOR0603  [0603]
R36  10k  RESISTOR0603  [0603]
R37  10k  RESISTOR0603  [0603]
R38  470  RESISTOR0603  [0603]
U2  MIC94081YFT-TR  [IC_MIC94081YFT-TR]

### Nets
3.3V: U2.3(VIN) ; also sheet 1,2,3,4,6
DAT0: J2.7(DAT0) R32.2 ; also sheet 1
DAT1: J2.8(DAT1) R33.2 ; also sheet 1
DAT2: J2.1(DAT2) R34.2 ; also sheet 1
DAT3: J2.2(CD/DAT3) R35.2 ; also sheet 1
GND: C42.2 C43.1 C51.2 IC10.5(GND) J2.6(VSS) J2.10(CARD_DET2) J2.G1(GND) J2.G2(GND) J2.G3(GND) J2.G4(GND) U2.2(GND) ; also sheet 1,2,3,4,6
I2C1_SCL: IC10.8(SCL) ; also sheet 1,6
I2C1_SDA: IC10.7(SDA) ; also sheet 1,6
N$20: JP8.1 LED19.C R38.2
SD_CLK: J2.5(CLK) R37.2 ; also sheet 1
SD_CMD: J2.3(CMD) R36.2 ; also sheet 1
SD_DETECT: J2.9(CARD_DET1) R38.1 ; also sheet 1
SD_EN: U2.4(EN) ; also sheet 1
VBAT: C43.2 IC10.6(VBAT) ; also sheet 4,6
VDD_RTC_EN: C42.1 IC10.2(VCC) ; also sheet 1
VDD_SD: C51.1 J2.4(VDD) JP9.1 LED19.A R32.1 R33.1 R34.1 R35.1 R36.1 R37.1 U2.1(VOUT)
Unconnected: IC10.1(32KHZ) IC10.3(!INT/SQW) IC10.4(!RST)

### Notes on the sheet
- Battery
- https://www.tinytronics.nl/shop/nl/batterij-en-accu/li-po/li-po-accu-3.7v-2600mah
- Jarne Van Mulders
- SD CARD
- DRAMCO

## Sheet 6 of 7
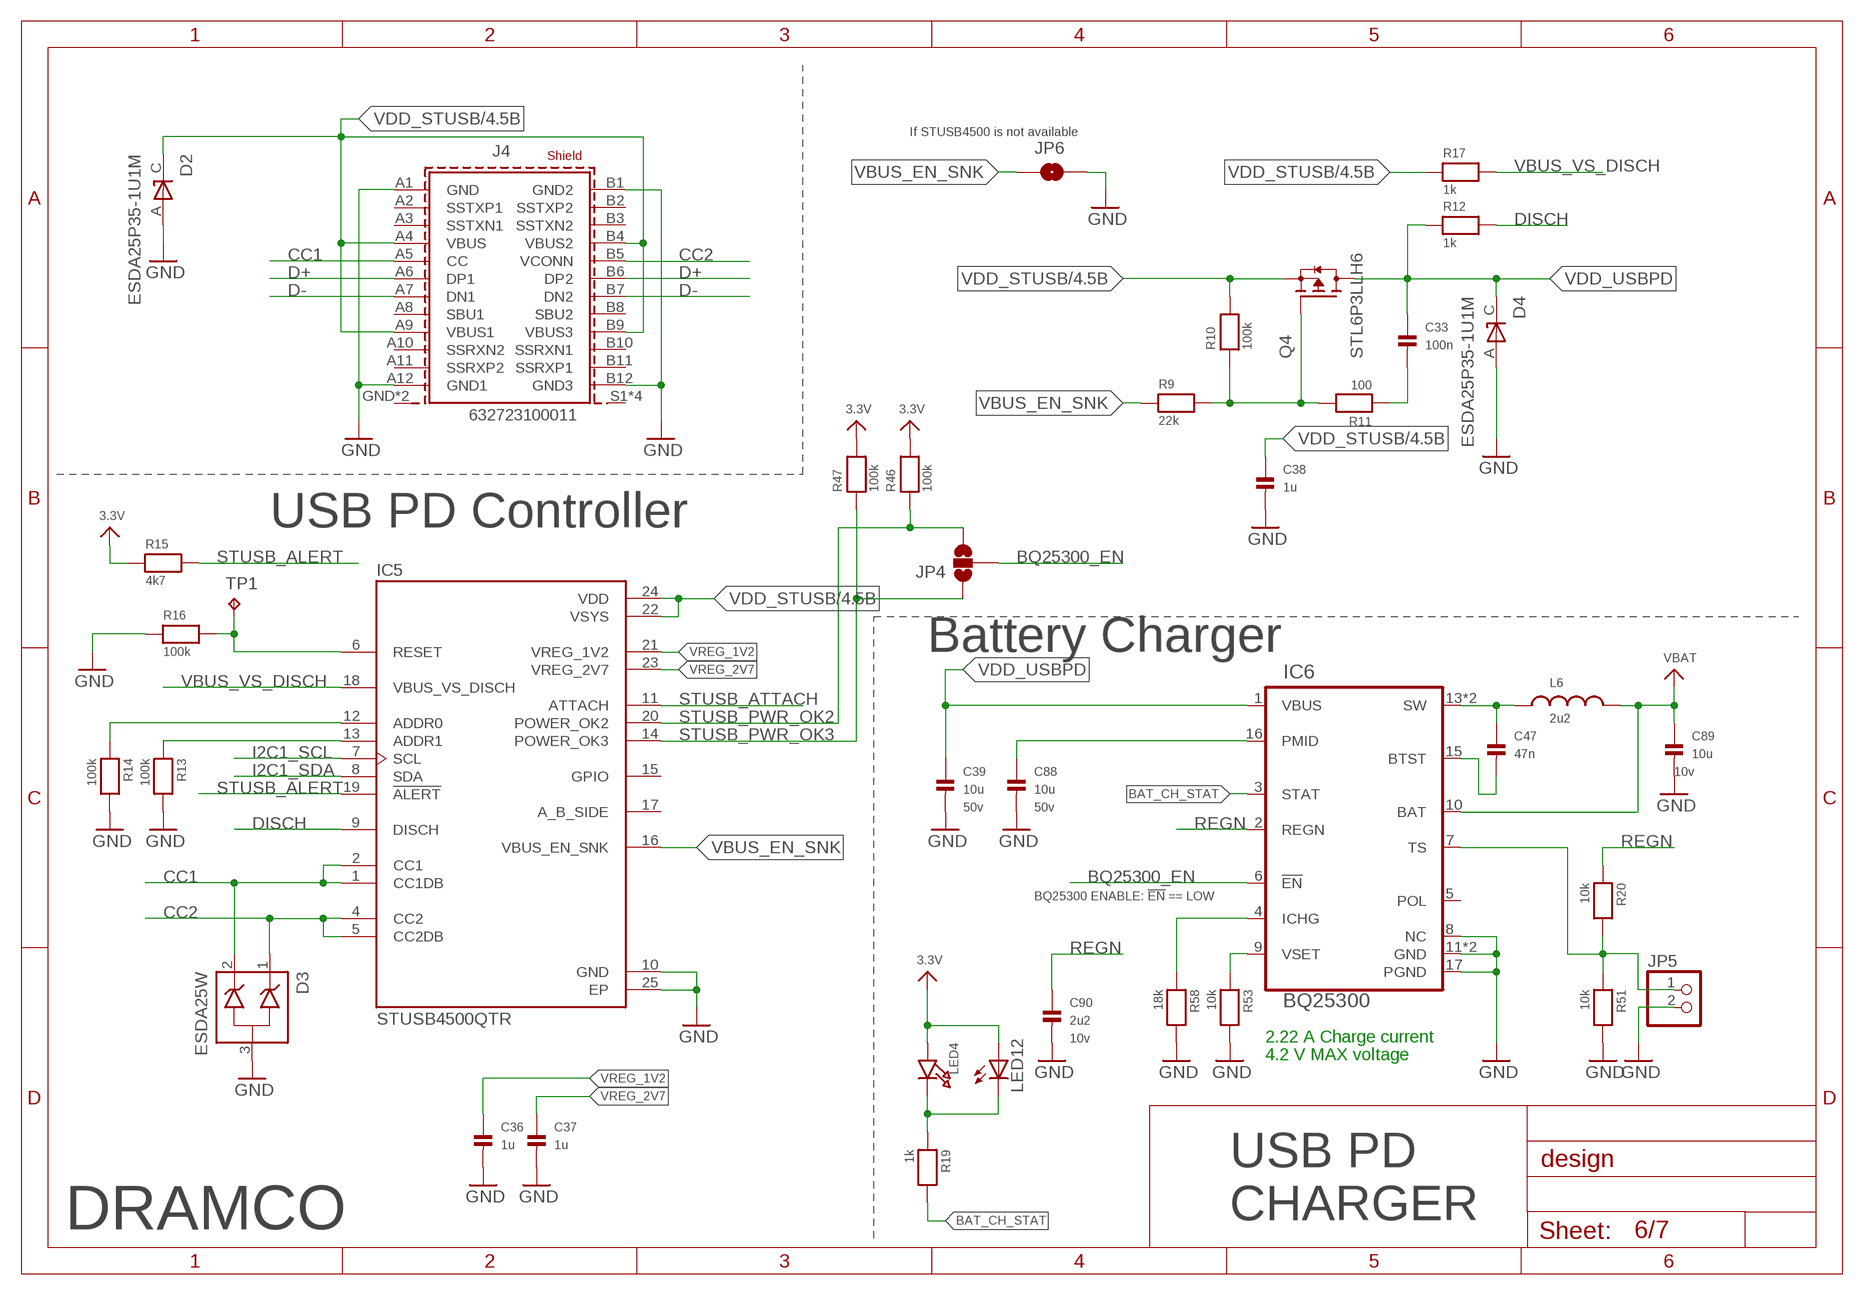
[diagram p5: schematic, sheet 6]

### Parts
C33  100n  CAP_CERAMIC0603  [0603]
C36  1u  CAP_CERAMIC0603  [0603]
C37  1u  CAP_CERAMIC0603  [0603]
C38  1u  CAP_CERAMIC0805  [0805]
C39  10u  CAP_CERAMIC1206  [1206]
C47  47n  CAP_CERAMIC0603  [0603]
C88  10u  CAP_CERAMIC1206  [1206]
C89  10u  CAP_CERAMIC0805  [0805]
C90  2u2  CAP_CERAMIC0603  [0603]
D2  ESDA25P35-1U1M  [TVS_ESDA25P35-1U1M]
D3  ESDA25W  [SOT65P210X110-3N]
D4  ESDA25P35-1U1M  [TVS_ESDA25P35-1U1M]
IC5  STUSB4500QTR  [QFN50P400X400X90-25N]
IC6  BQ25300  [QFN50P350X350X100-21N]
J4  632723100011  632723100011  [632723100011]
JP4  JUMPER-SMT_3_NO_NO-SILK  [SMT-JUMPER_3_NO_NO-SILK]
JP5  HEADER-1X2ROUND  [1X02_ROUND]
JP6  JUMPER-SMT_2_NO_NO-SILK  [SMT-JUMPER_2_NO_NO-SILK]
L6  2u2  WE-MAIA_3020_78438336022  [WE-MAIA_3020]
LED4  LED0805  [CHIPLED_0805]
LED12  LED3MM  [LED3MM]
Q4  STL6P3LLH6  [TRANS_STL6P3LLH6]
R9  22k  RESISTOR0603  [0603]
R10  100k  RESISTOR0603  [0603]
R11  100  RESISTOR0603  [0603]
R12  1k  RESISTOR0603  [0603]
R13  100k  RESISTOR0603  [0603]
R14  100k  RESISTOR0603  [0603]
R15  4k7  RESISTOR0603  [0603]
R16  100k  RESISTOR0603  [0603]
R17  1k  RESISTOR0603  [0603]
R19  1k  RESISTOR0603  [0603]
R20  10k  RESISTOR0603  [0603]
R46  100k  RESISTOR0603  [0603]
R47  100k  RESISTOR0603  [0603]
R51  10k  RESISTOR0603  [0603]
R53  10k  RESISTOR0603  [0603]
R58  18k  RESISTOR0603  [0603]
TP1  TPTP10R  [TP10R]

### Nets
3.3V: LED4.A LED12.A R15.1 R46.2 R47.2 ; also sheet 1,2,3,4,5
BAT_CH_STAT: IC6.3(STAT) R19.2 ; also sheet 1
BQ25300_EN: IC6.6(!EN) JP4.2
CC1: D3.2(C2) IC5.1(CC1DB) IC5.2(CC1) J4.A5(CC)
CC2: D3.1(C1) IC5.4(CC2) IC5.5(CC2DB) J4.B5(VCONN)
D+: J4.A6(DP1) J4.B6(DP2) ; also sheet 3
D-: J4.A7(DN1) J4.B7(DN2) ; also sheet 3
DISCH: IC5.9(DISCH) R12.2
GND: C36.2 C37.2 C38.2 C39.2 C88.2 C89.2 C90.2 D2.A D3.3(CA) D4.A IC5.10(GND) IC5.25(EP) IC6.8(NC) IC6.11(GND) IC6.12(GND) IC6.17(PGND) J4.A1(GND) J4.A12(GND1) J4.B1(GND2) J4.B12(GND3) JP5.2 JP6.2 R13.2 R14.2 R16.1 R51.2 R53.2 R58.2 ; also sheet 1,2,3,4,5
I2C1_SCL: IC5.7(SCL) ; also sheet 1,5
I2C1_SDA: IC5.8(SDA) ; also sheet 1,5
N$21: IC5.13(ADDR1) R13.1
N$23: C33.2 R11.1
N$25: Q4.4(G) R9.2 R10.1 R11.2
N$26: IC5.12(ADDR0) R14.1
N$27: IC5.6(RESET) R16.2 TP1.TP
N$30: IC6.9(VSET) R53.1
N$31: IC6.4(ICHG) R58.1
N$37: LED4.C LED12.K(C) R19.1
N$54: C47.2 IC6.15(BTST)
N$56: C88.1 IC6.16(PMID)
N$58: C47.1 IC6.13(SW) IC6.14(SW) L6.1
N$59: IC6.7(TS) JP5.1 R20.2 R51.1
REGN: C90.1 IC6.2(REGN) R20.1
STUSB_ALERT: IC5.19(!ALERT) R15.2 ; also sheet 1
STUSB_ATTACH: IC5.11(ATTACH) ; also sheet 1
STUSB_PWR_OK2: IC5.20(POWER_OK2) JP4.3 R46.1 ; also sheet 1
STUSB_PWR_OK3: IC5.14(POWER_OK3) JP4.1 R47.1 ; also sheet 1
VBAT: C89.1 IC6.10(BAT) L6.2 ; also sheet 4,5
VBUS_EN_SNK: IC5.16(VBUS_EN_SNK) JP6.1 R9.1
VBUS_VS_DISCH: IC5.18(VBUS_VS_DISCH) R17.2
VDD_STUSB: C38.1 D2.C IC5.22(VSYS) IC5.24(VDD) J4.A4(VBUS) J4.A9(VBUS1) J4.B4(VBUS2) J4.B9(VBUS3) Q4.1(S) Q4.2(S) Q4.3(S) R10.2 R17.1 ; also sheet 4
VDD_USBPD: C33.1 C39.1 D4.C IC6.1(VBUS) Q4.5_8(D) R12.1
VREG_1V2: C36.1 IC5.21(VREG_1V2)
VREG_2V7: C37.1 IC5.23(VREG_2V7)
Unconnected: IC5.15(GPIO) IC5.17(A_B_SIDE) IC6.5(POL) J4.A2(SSTXP1) J4.A3(SSTXN1) J4.A8(SBU1) J4.A10(SSRXN2) J4.A11(SSRXP2) J4.B2(SSTXP2) J4.B3(SSTXN2) J4.B8(SBU2) J4.B10(SSRXN1) J4.B11(SSRXP1) J4.GND1(SHIELD) J4.GND(SHIELD) J4.S1(SHIELD1) J4.S2(SHIELD1) J4.S3(SHIELD1) J4.S4(SHIELD1)

### Notes on the sheet
- If STUSB4500 is not available
- USB PD Controller
- Battery Charger
- 10v
- 50v | 50v
- BQ25300 ENABLE: !EN! == LOW
- 10v | 2.22 A Charge current
- 4.2 V MAX voltage
- USB PD
  CHARGER
- DRAMCO

## Sheet 7 of 7
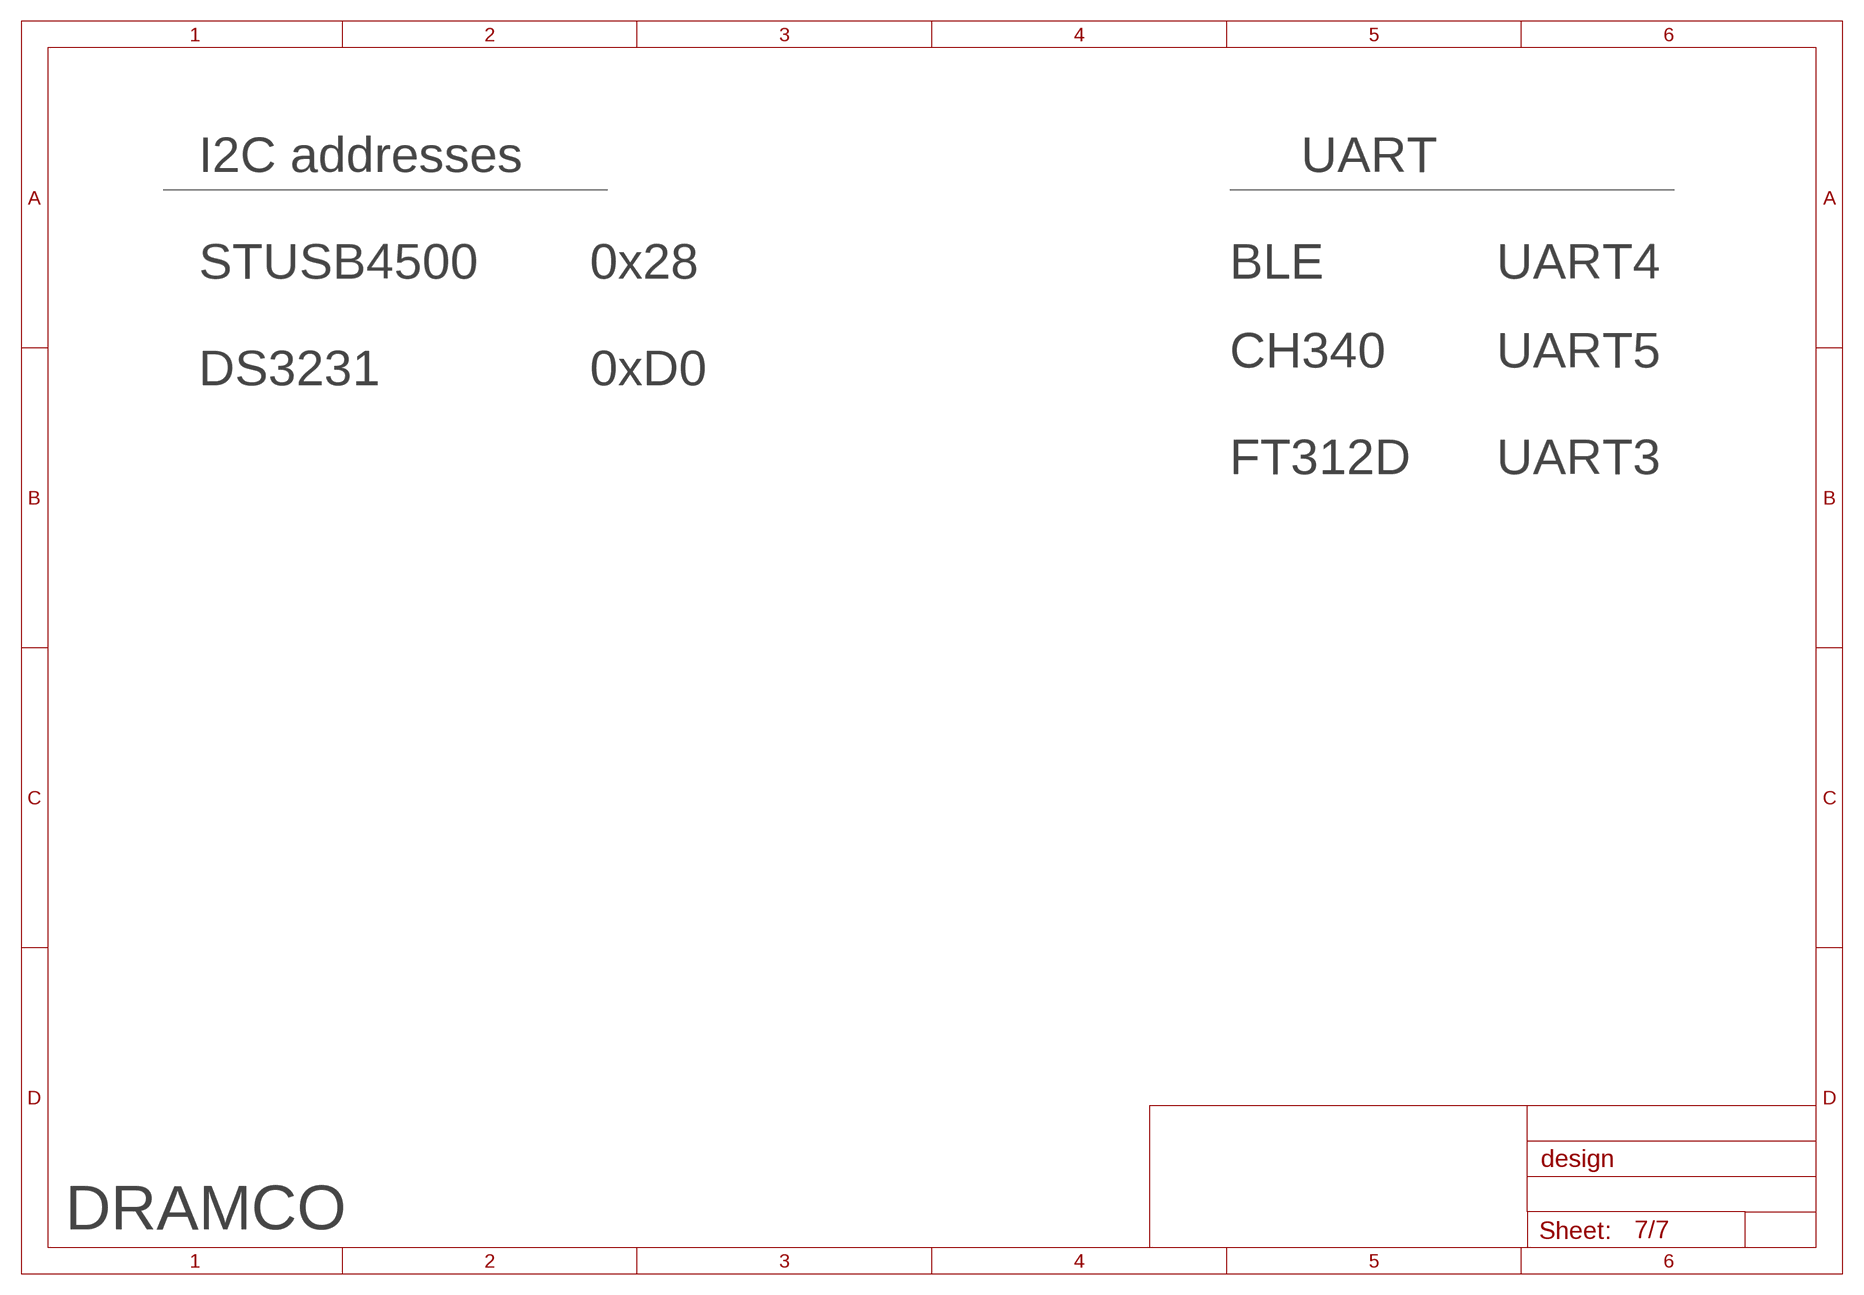
[diagram p6: schematic, sheet 7]

### Notes on the sheet
- I2C addresses | UART
- STUSB4500 | 0x28 | BLE | UART4
- CH340 | UART5
- DS3231 | 0xD0
- FT312D | UART3
- DRAMCO

## Library data of the parts
C1-C33 C35-C61 C75 C78-C83 C88-C90 = microbuilder:CAP_CERAMIC: Ceramic Capacitors 0402 - 0402 Surface Mount Capacitors 16pF 50V 5% [Digikey: 445-4899-2-ND] 18pF 50V 5% [Digikey: 490-1281-2-ND] 22pF 50V 5% [Digikey: 490-1283-2-ND] 68pF 50V 5% [Digikey: 490-1289-2-ND] 0.1uF 10V 10% [Digikey: 490-1318-2-ND] 1.0uF 6.3V 10% [Digikey: 490-1320-2-ND] 0603 - 0603 Surface Mount Capacitors 16 pF 50V 5% [Digikey: 445-5051-2-ND] 22 pF 50V [Digikey: PCC220ACVTR-ND] 33 pF 50V 5% [Digikey: 490-1415-1-ND] 56pF 50V 5% [Digikey: 490-1421-1-ND] 220pF 50V 5% [Digikey: 445-1285-1-ND] 680 pF 50V 2200 pF 50V 5% C0G [Digikey: 445-1297-1-ND] 5600 pF 100V 5% X7R [Digikey: 478-3711-1-ND] 0.1 µF 25V 10% [Digikey: PCC2277TR-ND] 0.22 µF 16V 10% X7R [Digikey: 445-1318-1-ND] 1.0 µF 25V 10% [Digikey: 445-5146-2-ND] 0603 - RF Specific 3pF 250V +/-0.1pF RF [Digikey: 712-1347-1-ND] 18 pF 250V 5% [Digikey: 478-3505-1-ND or 712-1322-1-ND] 56 pF 250V 5% C0G RF [Digikey: 490-4867-1-ND] 68 pF 250V RF [Digikey: 490-4868-1-ND] 0805 - 0805 Surface Mount Capacitors 220 pF 250V 2% RF Ceramic Capacitor [Digikey: 712-1398-1-ND] 1000 pF 50V 2% NP0 Ceramic Capacitor [Digikey: 478-3760-1-ND] 0.1 µF 25V 10% Ceramic Capacitor [Digikey: PCC1828TR-ND] 1.0 µF 16V 10% Ceramic Capacitor[Digikey: 490-1691-2-ND] 10.0 µF 10V 10% Ceramic Capacitor[Digikey: 709-1228-1-ND] 10.0 uF 16V 10% Ceramic Capacitor [Digikey: 478-5165-2-ND] 47 uF 6.3V 20% Ceramic Capacitor [Digikey: 587-1779-1-ND or 399-5506-1-ND] 1206 - 1206 Surface Mount Capacitors 47uF 10V 20% Ceramic Capacitor [Digikey: 490-5528-1-ND or 399-5508-1-ND or 445-6010-1-ND] 100uF 6.3V -20%, +80% Y5V Ceramic Capacitor (Digikey: 490-4512-1-ND, Mouser: 81-GRM31CF50J107ZE1L)
C62 C63 = nrf52832-breakout-temp:6PF: 15pF ceramic capacitors A capacitor is a passive two-terminal electrical component used to store electrical energy temporarily in an electric field.; PROD_ID: CAP-13455
C64 C65 = SparkFun-Capacitors:15PF: 15pF ceramic capacitors A capacitor is a passive two-terminal electrical component used to store electrical energy temporarily in an electric field.; PROD_ID: CAP-13063
C66 C68 C69 = SparkFun-Capacitors:0.1UF: 0.1µF ceramic capacitors A capacitor is a passive two-terminal electrical component used to store electrical energy temporarily in an electric field.; PROD_ID: CAP-12416
C67 = SparkFun-Capacitors:4.7UF: 4.7µF ceramic capacitors A capacitor is a passive two-terminal electrical component used to store electrical energy temporarily in an electric field.; PROD_ID: CAP-08280
C70 C74 = SparkFun-Passives:CAP: Capacitor Standard 0603 ceramic capacitor, and 0.1" leaded capacitor.
C71 = SparkFun-Capacitors:1.0UF: 1µF ceramic capacitors A capacitor is a passive two-terminal electrical component used to store electrical energy temporarily in an electric field.; PROD_ID: CAP-12417
C72 = nrf52832-breakout-temp:0.8PF: 0.8pF ceramic capacitors A capacitor is a passive two-terminal electrical component used to store electrical energy temporarily in an electric field.; PROD_ID: CAP-13456
C73 = nrf52832-breakout-temp:100PF: 100pF/0.1nF ceramic capacitors A capacitor is a passive two-terminal electrical component used to store electrical energy temporarily in an electric field.; PROD_ID: CAP-13458
C76 C77 = SparkFun-Capacitors:15PF: 15pF ceramic capacitors A capacitor is a passive two-terminal electrical component used to store electrical energy temporarily in an electric field.; PROD_ID: CAP-13063; VALUE: 15pF
C84 = Kondensatoren (rev17a):WCAP-ASLI: WCAP-ASLI Aluminum Electrolytic Capacitors Characteristics Aluminum Electrolytic Capacitor Recommended soldering: Reflow Operating temperature: -55 °C to +105 °C Low impedance product series Load life:2000 h @ +105 °C Package name and Variant abbreviation: Package: Package: B X C X A = length of the solder pad X width of the solder pad X pitch of the solder pad. <http://katalog.we-online.de/media/images/eisos/WCAP-ASLI_pf2.jpg> Details see: http://katalog.we-online.de/en/pbs/WCAP-ASLI Updated by: Yingchun,Shan Updated: 2017-03-16 2017 (C) Wurth Elektronik; WE-NUMBER: 865080143008/150uF
CRST = rcl:C-EU: CAPACITOR, European symbol; SPICEPREFIX: C
D1 D5 = microbuilder:DIODE: Diode SMA Model Volts Amps Type Vf Vr Digikey # Notes SSA34-E3 40V 3A Schottky 480mV @ 3A 200uA @ 40V SSA34-E3/61TGITR-ND CDBA120-G 20V 1A Schottky 500mV @ 1A 500uA @ 20V 641-1014-6-ND REEL MBRA210 10V 2A Schottky 350mV @ 2A 700uA @ 10V MBRA210LT3 SOD-123 Model Volts Amps Type Vf Vr Order # Notes BAT54T1G 30V 200mA Schottky 800mV @ 200mA 2uA @ 25V BAT54T1GOSTR-ND B0530W 30V 500mA Schottky 430mV @ 500mA 130uA @ 30V B0530W-FDICT-ND REEL MBR120 1A 20V Schottky 340mV @ 1A MBR120VLSFT1GOSCT-ND SOD-323 Model Volts Amps Type Vf Vr Order # Notes PMEG2005EJ 20V 500mA Schottky 355mV @ 500mA 568-4110-1-ND ZLLS410 10V 570mA Schottky 380mV @ 570mA ZLLS410CT-ND 1N4148WS 75V 150mA Silicon/Simple 1V 1N4148WSFSCT-ND REEL SOD-523 Model Volts Amps Type Vf Vr Order # Notes BAT54XV2 30V 200mA Schottky 0.8V @ 100mA BAT54XV2CT-ND TB751S 30V 30mA Schottky RB751S-40TE61CT-ND SOT23-R/W (R = Solder Paste/Reflow Ovens, W = Hand-Soldering) Model Volts Amps Type Vf Vr Order # Notes BAT54FILM 40V 300mA Schottky 497-7162-1-ND
D2 D4 = ESDA25P35-1U1M:ESDA25P35-1U1M: 41V Clamp 35A (8/20µs) Ipp Tvs Diode Surface Mount 1610 Check prices <https://pricing.snapeda.com/parts/ESDA25P35-1U1M/STMicroelectronics/view-part?ref=eda>; AVAILABILITY: In Stock; DESCRIPTION: 41V Clamp 35A (8/20µs) Ipp Tvs Diode Surface Mount 1610; MF: STMicroelectronics; MP: ESDA25P35-1U1M; PACKAGE: UDFN-2 STMicroelectronics; PRICE: None
D3 = ESDA25W:ESDA25W: Clamp Ipp Tvs Diode Surface Mount SOT-323 Check prices <https://pricing.snapeda.com/parts/ESDA25W/STMicroelectronics/view-part?ref=eda>; AVAILABILITY: In Stock; DESCRIPTION: Clamp Ipp Tvs Diode Surface Mount SOT-323; MF: STMicroelectronics; MP: ESDA25W; PACKAGE: SOT-323 STMicroelectronics; PRICE: None
DEBUG = SparkFun-Connectors:CORTEX_DEBUG: Cortex Debug Connector Datasheet <http://infocenter.arm.com/help/topic/com.arm.doc.faqs/attached/13634/cortex_debug_connectors.pdf>
H1-H4 = holes:MOUNT-HOLE: MOUNTING HOLE with drill center marker
IC1 = STM32H743ZIT6:STM32H743ZIT6: High-performance and DSP with DP-FPU, ARM Cortex-M7 MCU with 2MBytes Flash, 1MB RAM, 400 MHz CPU, Art Accelerator, L1...; AVAILABILITY: Unavailable; DESCRIPTION: ARM® Cortex®-M7 STM32H7 Microcontroller IC 32-Bit 480MHz 2MB _2M x 8_ FLASH 144-LQFP _20x20_; MF: STMicroelectronics; MP: STM32H743ZIT6; PACKAGE: LQFP-144 STMicroelectronics; PRICE: None
IC2 = FT312D:FT312D
IC3 = SN74LVC2G241DCUT:SN74LVC2G241DCUT: DUAL BUFFER/DRIVER WITH 3-STATE OUTPUTS; AVAILABILITY: Unavailable; DESCRIPTION: Buffer, Non-Inverting 2 Element 1 Bit per Element 3-State Output 8-VSSOP; MF: Texas Instruments; MP: SN74LVC2G241DCUT; PACKAGE: VFSOP-8 Texas Instruments; PRICE: None
IC4 = SparkFun-IC-Comms:CH340G: A simple USB 2.0 to Serial IC.; PROD_ID: IC-13498
IC5 = STUSB4500QTR:STUSB4500QTR: USB Type C and PD Sink Controller USB1.0/USB1.2/USB2.0/USB3.0 24-Pin QFN EP T/R Check prices <https://pricing.snapeda.com/parts/STUSB4500QTR/STMicroelectronics/view-part?ref=eda>; AVAILABILITY: In Stock; DESCRIPTION: USB Controller USB 2.0 I²C Interface 24-QFN (4x4); MF: STMicroelectronics; MP: STUSB4500QTR; PACKAGE: VFQFN-24 STMicroelectronics; PRICE: None
IC6 = BQ25300:BQ25300
IC7 = TLV61048DBVT:TLV61048DBVT: Check prices <https://pricing.snapeda.com/parts/TLV61048DBVT/Texas%20Instruments/view-part?ref=eda>; AVAILABILITY: In Stock; DESCRIPTION: 14-V output voltage non-synchronous boost converter in SOT-23 package 6-SOT-23 -40 to 125; MF: Texas Instruments; MP: TLV61048DBVT; PACKAGE: SOT-23-6 Texas Instruments; PRICE: None; PURCHASE-URL: https://pricing.snapeda.com/search/part/TLV61048DBVT/?ref=eda
IC8 = STCC2540:STCC2540: The STCC2540 device integrates, in one package, a USB charger controller, a wide bandwidth data switch, and a high current power switch. The device emulates several profiles compatible with the USB battery charging standard, BC1.2, Chinese telecommunications standard YD/T 1591-2009, and proprietary charger modes. The device asserts the charging flag in DCP modes if the charging current is higher than the threshold. In CDP mode, it asserts the charging flag after the CDP negotiation if the charging current is higher than the threshold. After the current drops below the threshold, the output is deasserted, allowing the host to turn off the high power DC-DC converter and reduce overall consumption in S4/S5 states, which is critical when the host is battery supplied.
IC9 = LTC3531EDDPBF:LTC3531EDDPBF: Check prices <https://pricing.snapeda.com/parts/LTC3531EDD%23PBF/Analog%20Devices/view-part?ref=eda>; AVAILABILITY: Good; DESCRIPTION: Buck-Boost Switching Regulator IC Positive Adjustable 2V 1 Output 200mA 8-WFDFN Exposed Pad; MF: Analog Devices; MP: LTC3531EDD#PBF; PACKAGE: DFN -8 Analog Devices; PRICE: None; PURCHASE-URL: https://pricing.snapeda.com/search/part/LTC3531EDD#PBF/?ref=eda
IC10 = DS3231MZ_TRL:DS3231MZ+TRL; AVAILABILITY: Unavailable; DESCRIPTION: Real Time Clock _RTC_ IC Clock/Calendar I²C, 2-Wire Serial 8-SOIC _0.154, 3.90mm Width_; MF: Maxim Integrated; MP: DS3231MZ+TRL; PACKAGE: SOIC-8 Maxim; PRICE: None
IC11 = TPS54331D:TPS54331D: Check prices <https://pricing.snapeda.com/parts/TPS54331D/Texas%20Instruments/view-part?ref=eda>; AVAILABILITY: In Stock; DESCRIPTION: 3.5V to 28V Input, 3A, 570kHz Step-Down Converter with Eco-mode 8-SOIC -40 to 150; MF: Texas Instruments; MP: TPS54331D; PACKAGE: SOIC-8 Texas Instruments; PRICE: None; PURCHASE-URL: https://pricing.snapeda.com/search/part/TPS54331D/?ref=eda
IC12 = nrf52832-breakout-temp:NRF52832: Nordic nRF52832 Bluetooth Smart/ANT/2.4GHz RF SoC The nRF52832 SoC is a powerful, highly flexible ultra-low power multiprotocol SoC ideally suited for Bluetooth® Smart ANT and 2.4GHz ultra low-power wireless applications. The nRF52832 SoC is built around a 32-bit ARM® Cortex™-M4F CPU with 512kB + 64kB RAM. The embedded 2.4GHz transceiver supports Bluetooth Smart, ANT and proprietary 2.4 GHz protocol stack. It is on air compatible with the nRF51 Series, nRF24L and nRF24AP Series products from Nordic Semiconductor. Product Page <https://www.nordicsemi.com/eng/Products/Bluetooth-low-energy2/nRF52832>; PROD_ID: IC-13460
J1 = InputOutputIO (rev19b):614004190021: USB TYPE A UP RIGHT THT - SHORT TYPE =>ConUSB2 614004190021 Characteristics INSULATOR:PBT FLAMMABILITY RATING: UL94-V0 COLOR: WHITE CONTACT PLATING: GOLD OVER Ni COVER MATERIAL: BRASS COVER PLATING: Ni QUALITY CLASS: 15000 MATING CYCLES OPERATING TEMPERATURE:-40°C UP TO +85°C COMPLIANCE: LEAD FREE AND ROHS ELECTRICAL CURRENT RATING: - PIN 1 & PIN 4: 3A - OTHER PINS: 0,5A WORKING VOLTAGE: 30 VAC MAX WITHSTANDING VOLTAGE: 500 VAC/MIN INSULATION RESISTANCE: > 1000 MΩ CONTACT RESISTANCE: 30 mΩ MAX <http://katalog.we-online.de/media/images/v2/Family_WR-COM_614004190021_4C.jpg> Details see: http://katalog.we-online.de/en/em/COM_2_0_THT_TYPE_A_HORIZONTAL/614004190021? 2015 (C) Wurth Elektronik
J2 = 104031-0811:104031-0811: 1.10mm Pitch microSD Memory Card Connector, SMT, Push-Pull Type, 1.42mm Height, with Detect Switch; AVAILABILITY: Unavailable; DESCRIPTION: 10 _8 + 2_ Position Card Connector Secure Digital - microSD™ Surface Mount, Right Angle Gold; MF: Molex; MP: 104031-0811; PACKAGE: None; PRICE: None
J3 = microbuilder:HEADER-1X6: PIN HEADER
J4 = Eagle_WR-USB (rev21b):632723100011: WR-COM USB 3.1 Type C Receptacle Horizontal THT/SMT Kind Properties Durability:10 000 Mating cycles Connector Type:USB 3.1 Type C Gender:Receptacle Type:Horizontal General Information Operating Temperature:-40up to +105 °C Compliance:RoHS Electrical Properties Working Voltage:20V (DC) Withstanding Voltage:100V (AC) Contact Resistance:30 mΩ Material Properties Insulator Material:LCP Insulator Flammability Rating:UL94 V-0 Color:Black Contact Material:Brass Contact Plating:2µ” Gold over 30µ” Pd-Ni Contact Type:Stamped Shielding Material:Steel Shielding Plating:Matte Tin <https://www.we-online.com/catalog/media/o144501v209%20Family_WR-COM_632723x00011.jpg> Details see: https://www.we-online.com/catalog/en/COM_3_1_THR_SMT_TYPE_C_RECEPTACLE_HORIZONTAL/ Updated by Ella Wu 2020-08-05 2020 (C) Würth Elektronik; APPLICATION: USB 3.1; DATASHEET-URL: https://www.we-online.com/catalog/datasheet/632723100011 .pdf; GERDER: Receptacle; INTERFACE-TYPE: Type C; IR1: 5A; MOUNT: THR; PACKAGING: Tape and Reel; PART-NUMBER: 632723100011; PINS: 24; TYPE: Horizontal; WORKING-VOLTAGE: 20V(DC)
JP1 JP6 JP7 SJ6 SJ7 SJ14 SJ15 = SparkFun-Jumpers:JUMPER-SMT_2_NO: Normally open jumper This jumper has two pads in close proximity to each other. Apply solder to close the connection. Round pads are easier to solder for beginners, but are a lot larger. SparkFun Product that uses the round pads: SparkFun EL Sequencer <https://www.sparkfun.com/products/12781>
JP2 = microbuilder:HEADER-1X3: PIN HEADER
JP3 JP5 JP10 = microbuilder:HEADER-1X2: PIN HEADER
JP4 = SparkFun-Jumpers:JUMPER-SMT_3_NO: Normally open jumper This jumper has three pads in close proximity to each other. Apply solder to close the connection(s).
JP8 JP9 = microbuilder:HEADER-1X1: PIN HEADER
L1 L6 = PowerMagnetics (rev18e):WE-MAIA_3020: WE-MAIA SMD Power Inductor Characteristics Magnetic iron alloy allows high rated currents Compact design Magnetically shielded Hight current capability and handles hight transient current spikes No acoustic noise and no leakage flux noise Operating temperature range:-40°C up to 125°C Applications Power supplies for smartphones, tablet PCs and other mobile devices DC/DC-converter for high current power supplies DC/DC-converter for Field Programmable Gate Array (FPGA) POL-converters Portable power like PDA, digital camera Mainboards/graphic cards Battery powered devices Wireless communication devices <http://katalog.we-online.de/media/images/v2/Family_WE-MAIA.jpg> Details see: http://katalog.we-online.de/en/pbs/WE-MAIA Created By Yingchun,Shan 2017-12-06 2017 (C) Wurth Elektronik; WE-NUMBER: 78438336022/2,2uH
L2 = nrf52832-breakout-temp:INDUCTOR: Inductors; PROD_ID: NDUC-13457
L3 L5 = microbuilder:INDUCTOR: Inductors
L4 = nrf52832-breakout-temp:INDUCTOR: Inductors; PROD_ID: NDUC-13457; VALUE: 3.9nH
L7 = SS4020-103MLB:SS4020-103MLB
L8 = PowerMagnetics (rev18e):WE-MAIA_4030: WE-MAIA SMD Power Inductor Characteristics Magnetic iron alloy allows high rated currents Compact design Magnetically shielded Hight current capability and handles hight transient current spikes No acoustic noise and no leakage flux noise Operating temperature range:-40°C up to 125°C Applications Power supplies for smartphones, tablet PCs and other mobile devices DC/DC-converter for high current power supplies DC/DC-converter for Field Programmable Gate Array (FPGA) POL-converters Portable power like PDA, digital camera Mainboards/graphic cards Battery powered devices Wireless communication devices <http://katalog.we-online.de/media/images/v2/Family_WE-MAIA.jpg> Details see: http://katalog.we-online.de/en/pbs/WE-MAIA Created By Yingchun,Shan 2017-12-06 2017 (C) Wurth Elektronik; WE-NUMBER: 78438357100/10uH
LED1-LED4 LED16 LED19 LED20 LED23 LED24 = microbuilder:LED: LED
LED5-LED12 = led:LED: LED
Q1 = microbuilder:MOSFET-N: N-Channel Mosfet LEGEND VDS: Voltage Drain-Source ID: Drain Current RDS(ON): Drain-Source On-State Resistance VGS(TH): Gate-Source Threshold Voltage CISS: Drain-Source Input Capacitance SOT-23 Name VDS ID RDS(ON) VGS(TH) CISS Order Number 2N7002E 60V 260mA 2.5 Ohm 2.5V @ 250uA 26.7pF @ 25V 2N7002ET1GOSTR-ND BSH103 30V 850mA 400 mOhm 400mV @ 1mA 83pF @ 24V BSH103,235-ND BSS138 60V 320mA 1.6 Ohm 1.5V @ 250uA 50pF @ 10V Mouser: 771-BSS138PW115 DMN2075U-7 20V 4.2A 38 mOhm 1V @ 250 uA 594.3pF @ 10V DMN2075U-7DICT-ND * BSS138 good choice for I2C level-shifting
Q4 = STL6P3LLH6:STL6P3LLH6: P-Channel 30V 6A (Tc) 2.9W (Tc) Surface Mount PowerFlat™ (3.3x3.3) Check prices <https://pricing.snapeda.com/parts/STL6P3LLH6/STMicroelectronics/view-part?ref=eda>; AVAILABILITY: In Stock; DESCRIPTION: P-Channel 30V 6A (Tc) 2.9W (Tc) Surface Mount PowerFlat™ (3.3x3.3); MF: STMicroelectronics; MP: STL6P3LLH6; PACKAGE: PowerVDFN-8 STMicroelectronics; PRICE: None
R1-R59 = microbuilder:RESISTOR: Resistors 0402 - 0402 Surface Mount Package 22 Ohm 1% 1/16W [Digikey: 311-22.0LRTR-ND] 33 Ohm 5% 1/16W 1.0K 5% 1/16W 1.5K 5% 1/16W 2.0K 1% 1/16W 10.0K 1% 1/16W [Digikey: 311-10.0KLRTR-ND] 10.0K 5% 1/16W [Digikey: RMCF0402JT10K0TR-ND] 12.1K 1% 1/16W [Digikey: 311-22.0LRTR-ND] 100.0K 5% 1/16W 0603 - 0603 Surface Mount Package 0 Ohm 1/10 Watt 1% Resistor 15 Ohm 1/10 Watt 1% Resistor 33 Ohm 1/10 Watt 1% Resistor 49.9 Ohm 1/10 Watt 1% Resistor 100 Ohm 1/10 Watt 1% Resistor 150 Ohm 1/10 Watt 1% Resistor 240 Ohm 1/10 Watt 1% Resistor 390 Ohm 1/10 Watt 1% Resistor 560 Ohm 1/10 Watt 1% Resistor 680 Ohm 1/10 Watt 1% Resistor 750 Ohm 1/10 Watt 1% Resistor 1.0K Ohm 1/10 Watt 1% Resistor 1.5K Ohm 1/10 Watt 1% Resistor 2.0K Ohm 1/10 Watt 1% Resistor 2.2K Ohm 1/10 Watt 1% Resistor 3.3K Ohm 1/10 Watt 1% Resistor 4.7K Ohm 1/10 Watt 1% Resistor 10.0K Ohm 1/10 Watt 1% Resistor 12.0K Ohm 1/10 Watt 1% Resistor 12.1K Ohm 1/10 Watt 1% Resistor 20.0K Ohm 1/10 Watt 1% Resistor 33.0K Ohm 1/10 Watt 1% Resistor 100.0K Ohm 1/10 Watt 1% Resistor 0805 - 0805 Surface Mount Package 0 Ohm 1/8 Watt 1% Resistor 33 Ohm 1/8 Watt 1% Resistor 100 Ohm 1/8 Watt 1% Resistor 150 Ohm 1/8 Watt 1% Resistor 200 Ohm 1/8 Watt 1% Resistor 240 Ohm 1/8 Watt 1% Resistor 330 Ohm 1/8 Watt 1% Resistor 390 Ohm 1/8 Watt 1% Resistor 470 Ohm 1/8 Watt 1% Resistor 1.0K Ohm 1/8 Watt 1% Resistor 1.5K Ohm 1/8 Watt 1% Resistor 2.0K Ohm 1/8 Watt 1% Resistor 4.7K Ohm 1/8 Watt 1% Resistor 5.1K Ohm 1/8 Watt 1% Resistor 5.6K Ohm 1/8 Watt 1% Resistor 10.0K Ohm 1/8 Watt 1% Resistor 22.0K Ohm 1/8 Watt 1% Resistor 33.0K Ohm 1/8 Watt 1% Resistor 100K Ohm 1/8 Watt 1% Resistor 1206 - 1206 Surface Mount Package 2012 - 2010 Surface Mount Package 0.11 Ohm 1/2 Watt 1% Resistor - Digikey: RHM.11UCT-ND
RESET UPDATE USER = Eagle_SWITCHES (rev18c):434111043826: 6.0x3.5 mm SMD WS-TASV <http://katalog.we-online.de/media/images/v2/Family_WS-TASV_6.0x3.jpg> Details see: http://katalog.we-online.de/em/datasheet/4341x1xxx8x6.pdf 2015 (C) Wurth Elektronik
SJ1-SJ4 = SparkFun-Jumpers:JUMPER-SMT_2_NC_TRACE: Normally closed trace jumper This jumper has a trace between two pads so it's normally closed (NC). Use a razor knife to open the connection. For best results follow the IPC guidelines for cutting traces: Cutout at least 0.063 mm (0.005 in). Remove all loose material to clean up the cut area. Seal the cut with an approved epoxy. Reapply solder to reclose the connection.
SYNC TP1-TP4 = testpad:TP: Test pad
U1-U5 = MIC94081YFT-TR:MIC94081YFT-TR: Power Switch/Driver 1:1 P-Channel 2A 4-TMLF® (0.85x0.85) Check prices <https://pricing.snapeda.com/parts/MIC94081YFT-TR/Microchip/view-part?ref=eda>; AVAILABILITY: In Stock; DESCRIPTION: Power Switch/Driver 1:1 P-Channel 2A 4-TMLF® (0.85x0.85); MF: Microchip; MP: MIC94081YFT-TR; PACKAGE: UFDFN-4 Microchip; PRICE: None
UART_INTERFACE = microbuilder:HEADER-1X4: PIN HEADER
X1 = Rembrandt Electronics - JST XH Connectors v1-0:JST-XH-02-PIN: JST XH Connector 2 Pin Wire to board connector. Pitch: 2,54 mm, (0.100") Number of pins: 2 Created by Rembrandt Electronics www.rembrandtelectronics.com
X2 = adafruit:ANTENNA_U.FL: U.FL Antenna Connector
XTAL XTAL1-XTAL3 = SparkFun-Clocks:CRYSTAL: Crystals (Generic) These are passive quartz crystals, which can be used as a clock source for a microcontroller. Crystal's are two-terminal devices. They require external "load" capacitors to generate an oscillating signal.
Y1 = nrf52832-breakout-temp:CRYSTAL-32MHZ: 32MHz Crystal Digikey Example <http://www.digikey.com/product-detail/en/murata-electronics-north-america/XRCGB32M000F2P00R0/490-9769-1-ND/4952013> Frequency: 32MHz Frequency Stability: ±20ppm Frequency Tolerance: ±20ppm Load Capacitance: 6pF; PROD_ID: XTAL-13459
Y2 = SparkFun-Clocks:CRYSTAL-32.768KHZ: 32.768kHz Crystal Frequency: 32.768kHz Frequency Stability: ±20ppm Load Capacitance: 12.5pF (PTH-2X6 & SMD-3.2X1.5), 6pF (SMD-2X6); PROD_ID: XTAL-13062